# EAGLE board RT5350F_OLinuXino_Rev_F (EAGLE 4.16), part 1 of 2
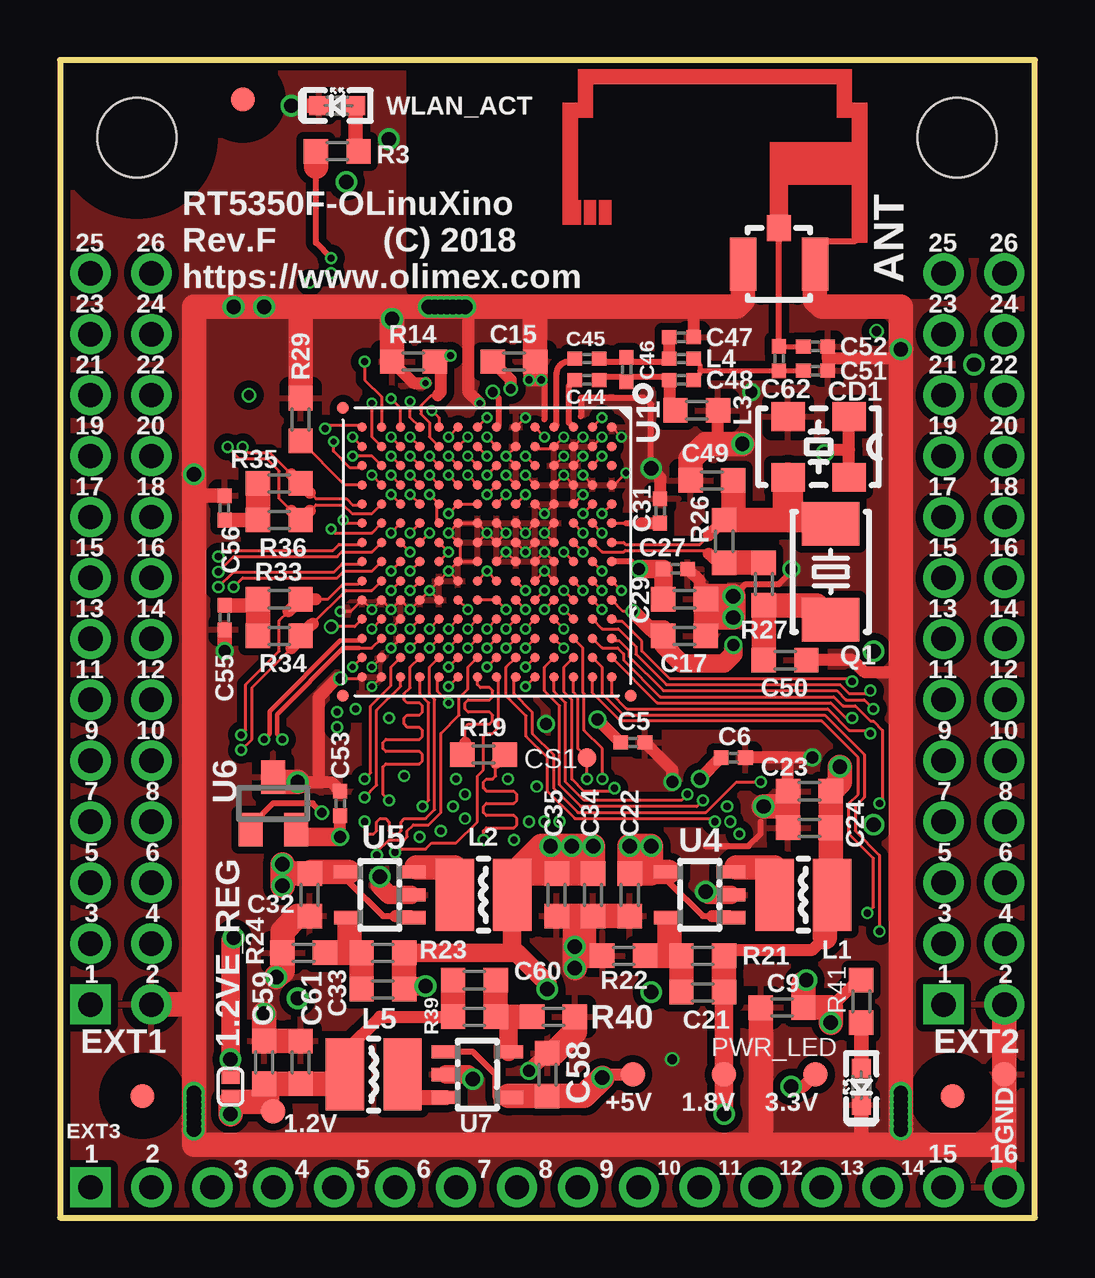
[diagram p2: board, top side]
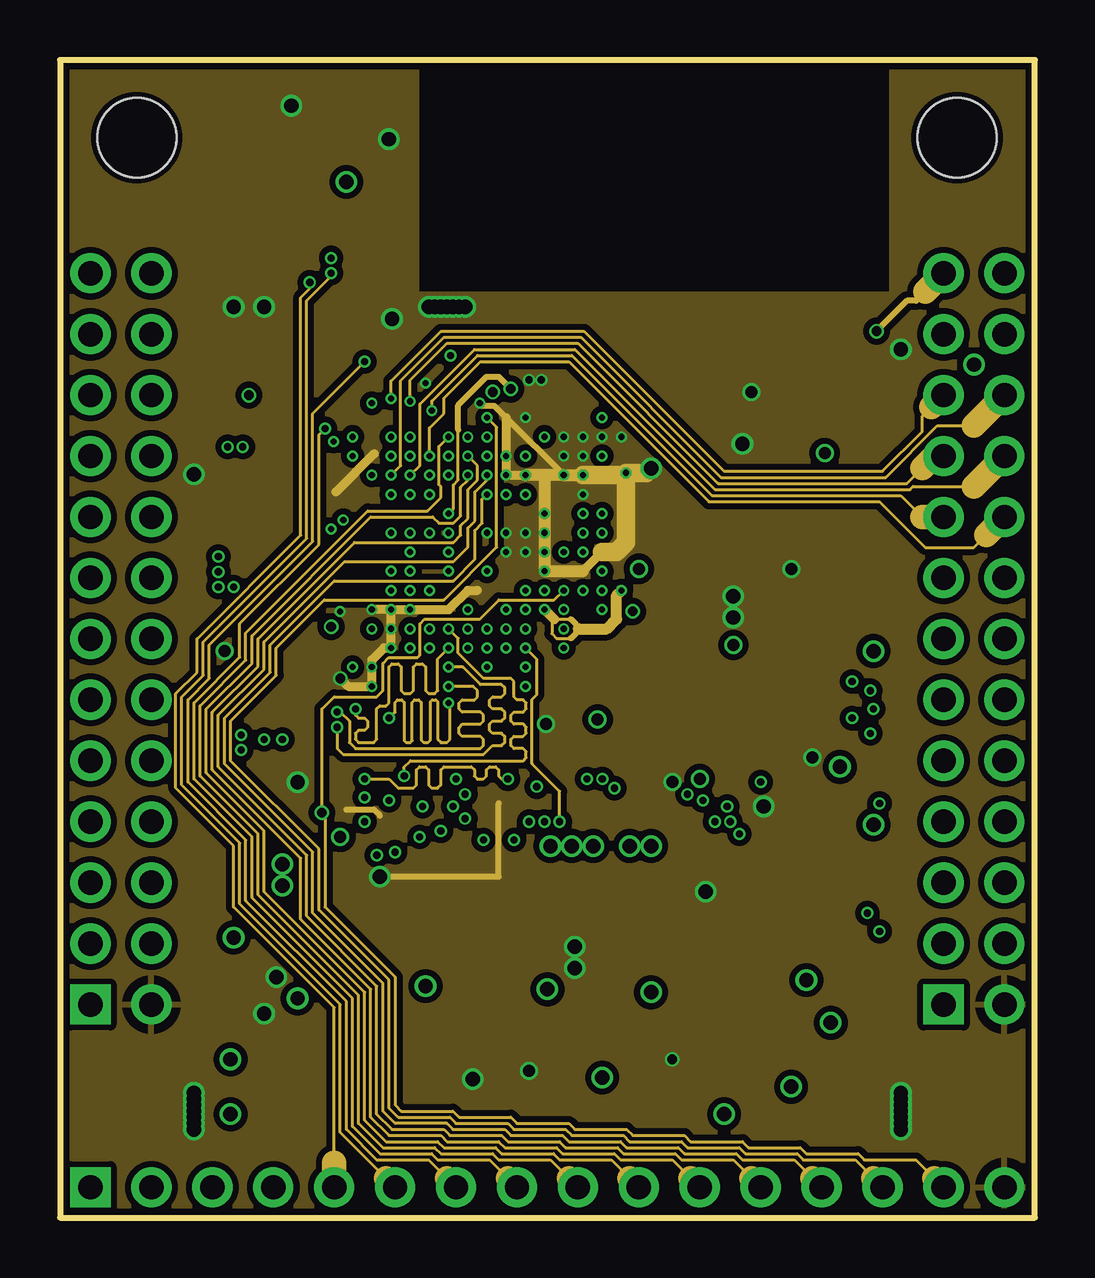
[diagram p3: board, inner layer GND]
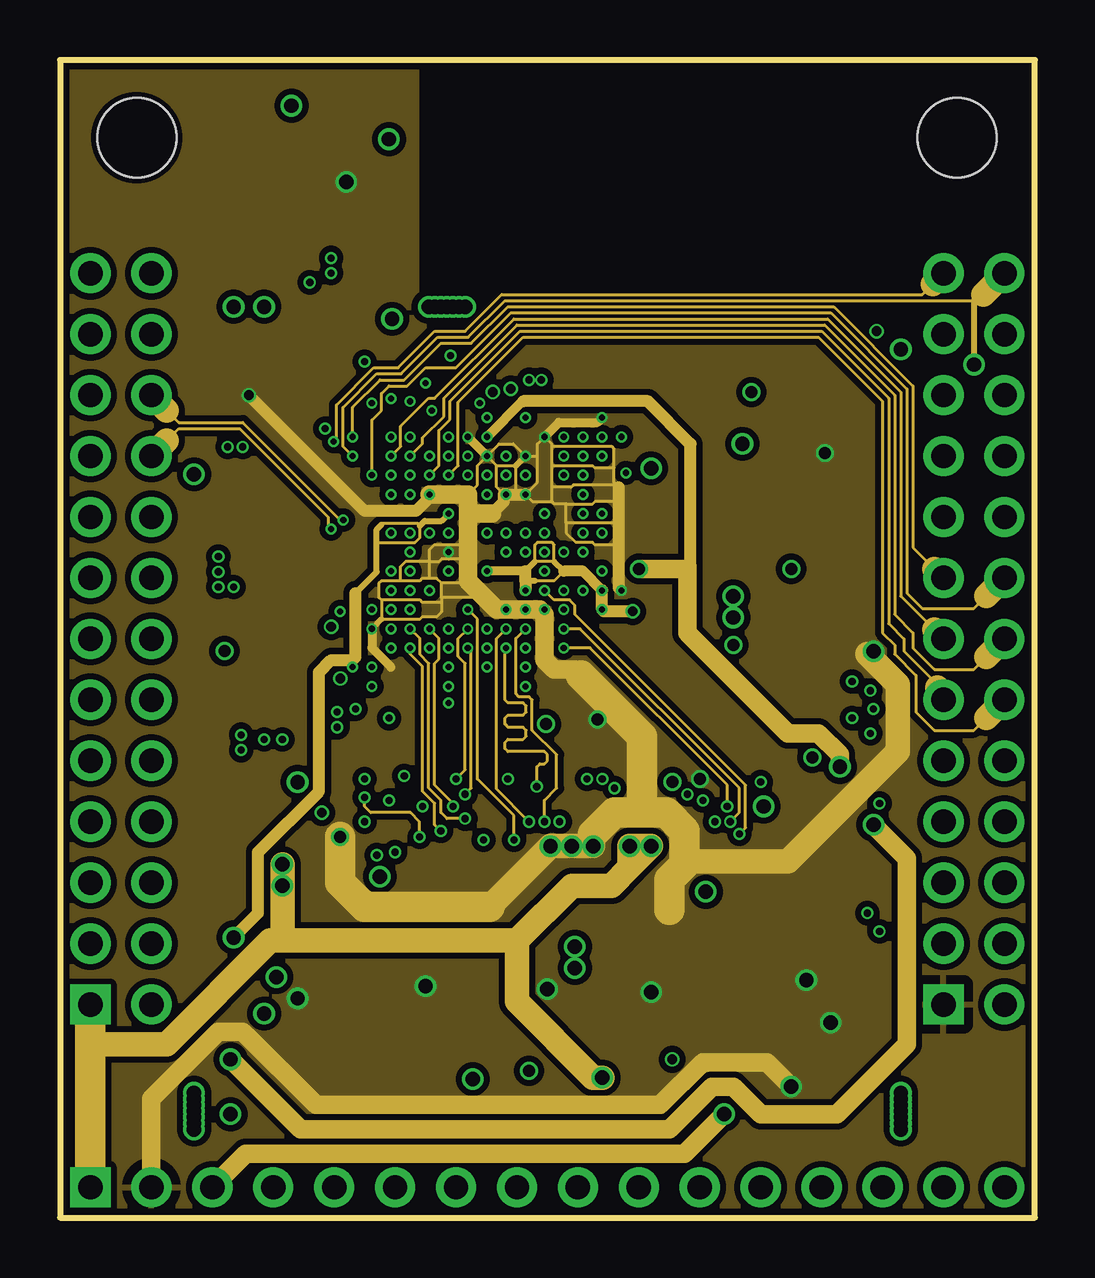
[diagram p4: board, inner layer PWR]
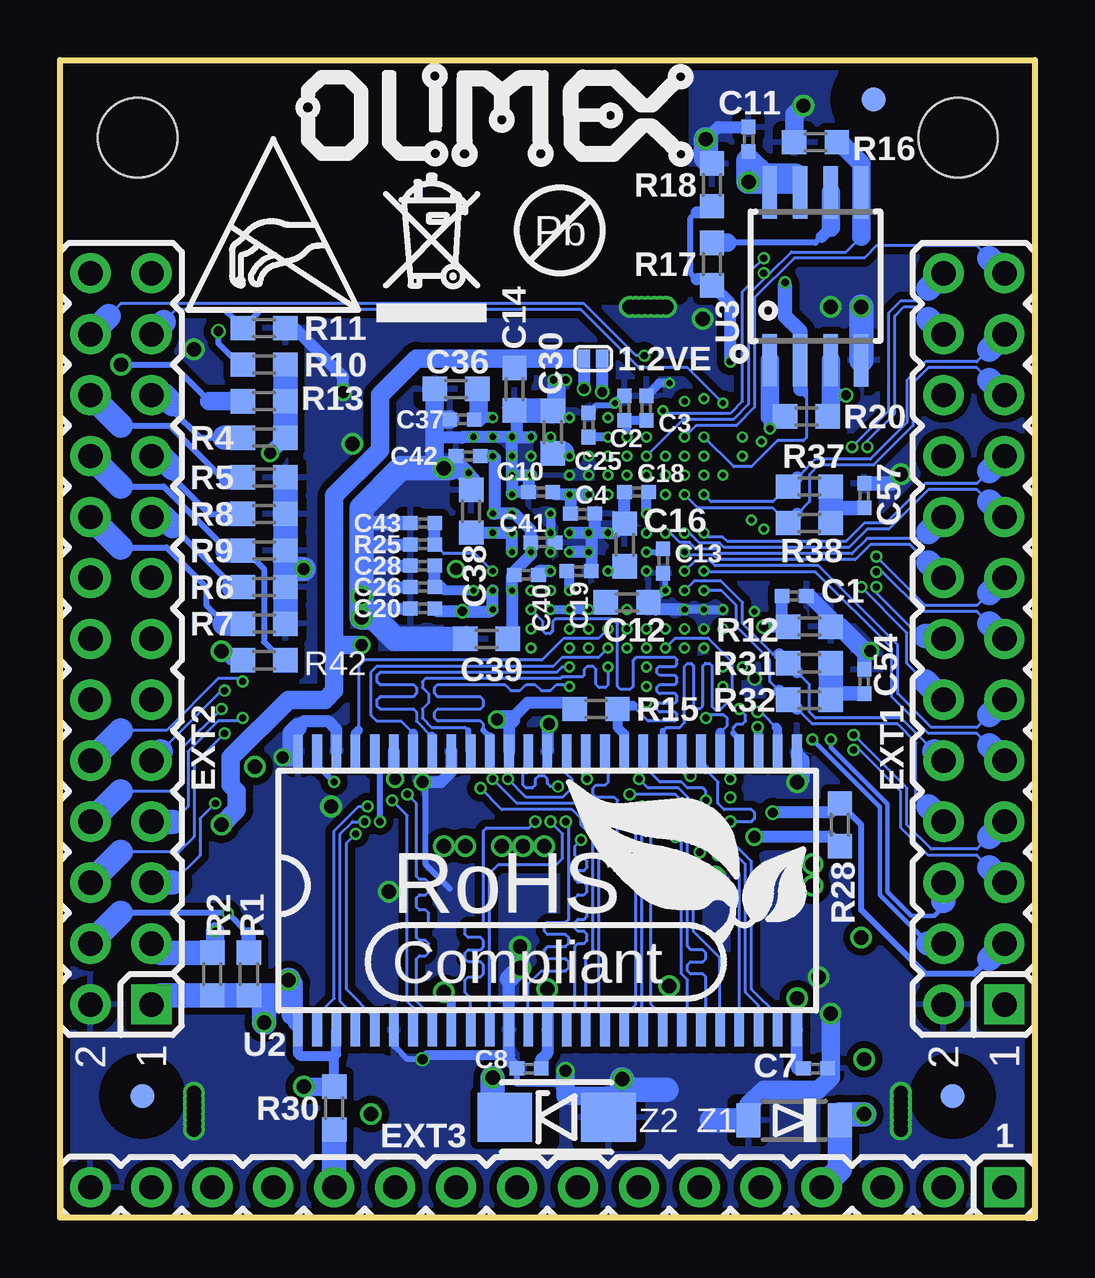
[diagram p5: board, bottom side, seen from below]

Size 40.64 x 48.26 mm. Coordinates in mm from the lower left corner, seen from the top.
Outline: 0,0 40.64,0 40.64,48.26 0,48.26 0,0
Copper layers (1+2*15+16): Top 0.035mm / dielectric 0.127mm / GND 0.035mm / dielectric 1.1mm / PWR 0.035mm / dielectric 0.127mm / Bottom 0.035mm
Design rules "default": minimum track width 4mil, minimum drill 0.25mm, track to track 5mil, track to pad 5mil, pad to pad 5mil, via to via 5mil, smd to smd 1mil, copper to edge 10mil, drill to drill 8mil, minimum pad ring 6mil, minimum via ring 4mil, stop-mask expansion 4mil, vias tented up to drill 28mil, thermal gap 15mil
Holes 3.3 mm at 3.2,45.02 37.4,45.02
tRestrict: area 34.4,42 to 40.4,48; area 0.2,42 to 6.2,48; 4 lines
bRestrict: area 0.2,42 to 6.2,48; area 34.4,42 to 40.4,48; 8 lines

## Footprints (pad centres in the part's own frame; a part is rotated, then mirrored left to right if it is on the bottom)
TESTPAD_40-ROUND = smd 1.016 x 1.016: 1 0,0
SJ_1_SMALLER = smd 0.508 x 0.762: 1 -0.381,0; 2 0.381,0
WIFI_RF = smd 1.1 x 1: ANT -2.183,0 | smd 2.2 x 1.1: GND1 -3.683,1.5; GND2 -3.683,-1.5
C0402_TI = smd 0.61 x 0.584: 1 -0.508,0; 2 0.508,0
C0603_DWS = smd 1.016 x 1.016: 1 -0.889,0; 2 0.889,0
5032-4P_HCX-3S = smd 1.4 x 1.2: 1 -1.27,-1.27; 2 1.27,-1.27; 3 1.27,1.27; 4 -1.27,1.27
TESTPAD_30-ROUND = smd 0.762 x 0.762: 1 0,0
HN2X13-MALE = drill 1.016 pad 1.676 square: 1 -15.24,-1.27 | drill 1.016 pad 1.676 round: 2 -15.24,1.27; 3 -12.7,-1.27; 4 -12.7,1.27; 5 -10.16,-1.27; 6 -10.16,1.27; 7 -7.62,-1.27; 8 -7.62,1.27; 9 -5.08,-1.27; 10 -5.08,1.27; 11 -2.54,-1.27; 12 -2.54,1.27; 13 0,-1.27; 14 0,1.27; 15 2.54,-1.27; 16 2.54,1.27; 17 5.08,-1.27; 18 5.08,1.27; 19 7.62,-1.27; 20 7.62,1.27; 21 10.16,-1.27; 22 10.16,1.27; 23 12.7,-1.27; 24 12.7,1.27; 25 15.24,-1.27; 26 15.24,1.27
HN1X16 = drill 1.016 pad 1.676 square: 1 -17.78,0 | drill 1.016 pad 1.676 round: 2 -15.24,0; 3 -12.7,0; 4 -10.16,0; 5 -7.62,0; 6 -5.08,0; 7 -2.54,0; 8 0,0; 9 2.54,0; 10 5.08,0; 11 7.62,0; 12 10.16,0; 13 12.7,0; 14 15.24,0; 15 17.78,0; 16 20.32,0
FIDUCIAL-1X3 = smd 1 x 1: 1 0,0
CD32 = smd 1.6 x 3: 1 -1.2,0; 2 1.2,0
L0603_5MIL_DWS = smd 1.016 x 1.016: 1 -0.889,0; 2 0.889,0
L0402_TI = smd 0.61 x 0.584: 1 -0.508,0; 2 0.508,0
LED-0603 = smd 0.8 x 0.8: A 0.762,0; C -0.762,0
HCX-4S = smd 1.8 x 2.4: 1 -2,0; 2 2,0
R0603_5MIL_DWS = smd 1.016 x 1.016: 1 -0.889,0; 2 0.889,0
R0402_TI = smd 0.61 x 0.584: 1 -0.508,0; 2 0.508,0
TFBGA196B = smd 0.4 x 0.4: A1 -5.2,-5.2; A2 -5.2,-4.4; A3 -5.2,-3.6; A4 -5.2,-2.8; A5 -5.2,-2; A6 -5.2,-1.2; A7 -5.2,-0.4; A8 -5.2,0.4; A9 -5.2,1.2; A10 -5.2,2; A11 -5.2,2.8; A12 -5.2,3.6; A13 -5.2,4.4; A14 -5.2,5.2; B1 -4.4,-5.2; B2 -4.4,-4.4; B3 -4.4,-3.6; B4 -4.4,-2.8; B5 -4.4,-2; B6 -4.4,-1.2; B7 -4.4,-0.4; B8 -4.4,0.4; B9 -4.4,1.2; B10 -4.4,2; B11 -4.4,2.8; B12 -4.4,3.6; B13 -4.4,4.4; B14 -4.4,5.2; C1 -3.6,-5.2; C2 -3.6,-4.4; C3 -3.6,-3.6; C4 -3.6,-2.8; C5 -3.6,-2; C6 -3.6,-1.2; C7 -3.6,-0.4; C8 -3.6,0.4; C9 -3.6,1.2; C10 -3.6,2; C11 -3.6,2.8; C12 -3.6,3.6; C13 -3.6,4.4; C14 -3.6,5.2; D1 -2.8,-5.2; D2 -2.8,-4.4; D3 -2.8,-3.6; D4 -2.8,-2.8; D5 -2.8,-2; D6 -2.8,-1.2; D7 -2.8,-0.4; D8 -2.8,0.4; D9 -2.8,1.2; D10 -2.8,2; D11 -2.8,2.8; D12 -2.8,3.6; D13 -2.8,4.4; D14 -2.8,5.2; E1 -2,-5.2; E2 -2,-4.4; E3 -2,-3.6; E4 -2,-2.8; E5 -2,-2; E6 -2,-1.2; E7 -2,-0.4; E8 -2,0.4; E9 -2,1.2; E10 -2,2; E11 -2,2.8; E12 -2,3.6; E13 -2,4.4; E14 -2,5.2; F1 -1.2,-5.2; F2 -1.2,-4.4; F3 -1.2,-3.6; F4 -1.2,-2.8; F5 -1.2,-2; F6 -1.2,-1.2; F7 -1.2,-0.4; F8 -1.2,0.4; F9 -1.2,1.2; F10 -1.2,2; F11 -1.2,2.8; F12 -1.2,3.6; F13 -1.2,4.4; F14 -1.2,5.2; G1 -0.4,-5.2; G2 -0.4,-4.4; G3 -0.4,-3.6; G4 -0.4,-2.8; G5 -0.4,-2; G6 -0.4,-1.2; G7 -0.4,-0.4; G8 -0.4,0.4; G9 -0.4,1.2; G10 -0.4,2; G11 -0.4,2.8; G12 -0.4,3.6; G13 -0.4,4.4; G14 -0.4,5.2; H1 0.4,-5.2; H2 0.4,-4.4; H3 0.4,-3.6; H4 0.4,-2.8; H5 0.4,-2; H6 0.4,-1.2; H7 0.4,-0.4; H8 0.4,0.4; H9 0.4,1.2; H10 0.4,2; H11 0.4,2.8; H12 0.4,3.6; H13 0.4,4.4; H14 0.4,5.2; J1 1.2,-5.2; J2 1.2,-4.4; J3 1.2,-3.6; J4 1.2,-2.8; J5 1.2,-2; J6 1.2,-1.2; J7 1.2,-0.4; J8 1.2,0.4; J9 1.2,1.2; J10 1.2,2; J11 1.2,2.8; J12 1.2,3.6; J13 1.2,4.4; J14 1.2,5.2; K1 2,-5.2; K2 2,-4.4; K3 2,-3.6; K4 2,-2.8; K5 2,-2; K6 2,-1.2; K7 2,-0.4; K8 2,0.4; K9 2,1.2; K10 2,2; K11 2,2.8; K12 2,3.6; K13 2,4.4; K14 2,5.2; L1 2.8,-5.2; L2 2.8,-4.4; L3 2.8,-3.6; L4 2.8,-2.8; L5 2.8,-2; L6 2.8,-1.2; L7 2.8,-0.4; L8 2.8,0.4; L9 2.8,1.2; L10 2.8,2; L11 2.8,2.8; L12 2.8,3.6; L13 2.8,4.4; L14 2.8,5.2; M1 3.6,-5.2; M2 3.6,-4.4; M3 3.6,-3.6; M4 3.6,-2.8; M5 3.6,-2; M6 3.6,-1.2; M7 3.6,-0.4; M8 3.6,0.4; M9 3.6,1.2; M10 3.6,2; M11 3.6,2.8; M12 3.6,3.6; M13 3.6,4.4; M14 3.6,5.2; N1 4.4,-5.2; N2 4.4,-4.4; N3 4.4,-3.6; N4 4.4,-2.8; N5 4.4,-2; N6 4.4,-1.2; N7 4.4,-0.4; N8 4.4,0.4; N9 4.4,1.2; N10 4.4,2; N11 4.4,2.8; N12 4.4,3.6; N13 4.4,4.4; N14 4.4,5.2; P1 5.2,-5.2; P2 5.2,-4.4; P3 5.2,-3.6; P4 5.2,-2.8; P5 5.2,-2; P6 5.2,-1.2; P7 5.2,-0.4; P8 5.2,0.4; P9 5.2,1.2; P10 5.2,2; P11 5.2,2.8; P12 5.2,3.6; P13 5.2,4.4; P14 5.2,5.2 | smd 0.5 x 0.5: FID1 6,-6; FID2 -6,6; FID3 6,6
54TSOPII = smd 0.4 x 1.4: 1 -10.4,-6; 2 -9.6,-6; 3 -8.8,-6; 4 -8,-6; 5 -7.2,-6; 6 -6.4,-6; 7 -5.6,-6; 8 -4.8,-6; 9 -4,-6; 10 -3.2,-6; 11 -2.4,-6; 12 -1.6,-6; 13 -0.8,-6; 14 0,-6; 15 0.8,-6; 16 1.6,-6; 17 2.4,-6; 18 3.2,-6; 19 4,-6; 20 4.8,-6; 21 5.6,-6; 22 6.4,-6; 23 7.2,-6; 24 8,-6; 25 8.8,-6; 26 9.6,-6; 27 10.4,-6; 28 10.4,5.6; 29 9.6,5.6; 30 8.8,5.6; 31 8,5.6; 32 7.2,5.6; 33 6.4,5.6; 34 5.6,5.6; 35 4.8,5.6; 36 4,5.6; 37 3.2,5.6; 38 2.4,5.6; 39 1.6,5.6; 40 0.8,5.6; 41 0,5.6; 42 -0.8,5.6; 43 -1.6,5.6; 44 -2.4,5.6; 45 -3.2,5.6; 46 -4,5.6; 47 -4.8,5.6; 48 -5.6,5.6; 49 -6.4,5.6; 50 -7.2,5.6; 51 -8,5.6; 52 -8.8,5.6; 53 -9.6,5.6; 54 -10.4,5.6
SO-8-BIG = smd 0.6 x 2.2: 1 -1.905,-3.5; 2 -0.635,-3.5; 3 0.635,-3.5; 4 1.905,-3.5; 5 1.905,3.5; 6 0.635,3.5; 7 -0.635,3.5; 8 -1.905,3.5
SOT23-5 = smd 1.2 x 0.55: 1 1.3,-0.95; 2 1.3,0; 3 1.3,0.95; 4 -1.3,0.95; 5 -1.3,-0.95
SOT23 = smd 1.4 x 1: 1 1.1,-0.95; 2 1.1,0.95; 3 -1.1,0
SOD-123 = smd 1 x 1.4: A 1.9,0; C -1.9,0
DO214AC = smd 2.286 x 2.032: A -2.159,0; C 2.159,0

## Placement (x,y rotation side)
1.2V  TESTPADTESTPAD_40-ROUND  [TESTPAD_40-ROUND]  8.89,4.44 0 top
1.2VE  Open  [SJ_1_SMALLER]  18.41,35.81 0 bottom
1.2VE_REG  Close  [SJ_1_SMALLER]  7.11,5.46 90 top
1.8V  TESTPADTESTPAD_40-ROUND  [TESTPAD_40-ROUND]  27.69,5.97 270 top
3.3V  3.3V  [TESTPAD_40-ROUND]  31.5,5.97 270 top
+5V  TESTPADTESTPAD_40-ROUND  [TESTPAD_40-ROUND]  23.88,5.97 180 top
ANT  WIFI_RF_I-PEX  [WIFI_RF]  29.97,43.43 90 top
C1  100nF  [C0402_TI]  10.03,25.92 0 bottom
C2  100nF  [C0402_TI]  17.1,33.75 90 bottom
C3  100nF  [C0402_TI]  16.2,33.75 90 bottom
C4  100nF  [C0402_TI]  18.85,29.35 0 bottom
C5  100nF  [C0402_TI]  23.88,19.81 0 top
C6  100nF  [C0402_TI]  28.07,19.18 0 top
C7  100nF  [C0402_TI]  9.14,6.22 0 bottom
C8  100nF  [C0402_TI]  21.08,6.22 180 bottom
C9  22uF/6.3V  [C0603_DWS]  30.1,8.76 180 top
C10  100nF  [C0402_TI]  20.6,30.25 180 bottom
C11  NA(100nF)  [C0402_TI]  11.94,44.96 90 bottom
C12  1uF  [C0603_DWS]  17,25.65 0 bottom
C13  100nF  [C0402_TI]  15.5,27.38 270 bottom
C14  1uF  [C0603_DWS]  21.69,34.54 270 bottom
C15  1uF  [C0603_DWS]  18.92,35.69 0 top
C16  1uF  [C0603_DWS]  17.1,28.05 90 bottom
C17  1uF  [C0603_DWS]  26.04,24.26 0 top
C18  100nF  [C0402_TI]  16.6,30.25 180 bottom
C19  100nF  [C0402_TI]  19,26.95 0 bottom
C20  100nF  [C0402_TI]  25.53,25.4 180 bottom
C21  22pF  [C0603_DWS]  26.8,9.4 180 top
C22  22uF/6.3V  [C0603_DWS]  23.75,13.46 270 top
C23  22uF/6.3V  [C0603_DWS]  31.24,17.78 180 top
C24  22uF/6.3V  [C0603_DWS]  31.24,16.26 180 top
C25  100nF  [C0402_TI]  18.6,33.05 90 bottom
C26  100nF  [C0402_TI]  25.53,26.29 180 bottom
C27  100nF  [C0402_TI]  25.65,27.05 0 top
C28  10pF  [C0402_TI]  25.53,27.18 180 bottom
C29  1uF  [C0603_DWS]  26.04,25.78 0 top
C30  1uF  [C0603_DWS]  20.1,32.75 90 bottom
C31  22nF  [C0402_TI]  25.02,29.46 90 top
C32  22uF/6.3V  [C0603_DWS]  10.41,13.46 270 top
C33  22pF  [C0603_DWS]  13.46,9.52 180 top
C34  22uF/6.3V  [C0603_DWS]  22.23,13.46 270 top
C35  22uF/6.3V  [C0603_DWS]  20.7,13.46 270 top
C36  1uF  [C0603_DWS]  24.13,34.54 180 bottom
C37  10pF  [C0402_TI]  23.88,33.27 180 bottom
C38  1uF  [C0603_DWS]  23.5,29.45 90 bottom
C39  1uF  [C0603_DWS]  22.86,24.13 180 bottom
C40  100pF  [C0402_TI]  21.2,26.8 0 bottom
C41  10pF  [C0402_TI]  20.5,28.15 0 bottom
C42  100nF  [C0402_TI]  23.62,31.75 180 bottom
C43  100pF  [C0402_TI]  25.53,28.96 180 bottom
C44  2.7pF  [C0402_TI]  21.97,34.92 0 top
C45  2.7pF  [C0402_TI]  21.97,35.81 0 top
C46  1.5pF  [C0402_TI]  23.62,35.36 270 top
C47  1.2pF  [C0402_TI]  25.91,36.7 0 top
C48  1.2pF  [C0402_TI]  25.91,34.92 0 top
C49  NA(6.8pF)  [C0603_DWS]  27.18,30.73 180 top
C50  22pF  [C0603_DWS]  30.23,23.24 0 top
C51  NA  [C0402_TI]  31.5,35.31 0 top
C52  NA  [C0402_TI]  31.5,36.32 0 top
C53  100nF  [C0402_TI]  11.68,17.27 90 top
C54  100nF  [C0402_TI]  7.11,22.35 90 bottom
C55  100nF  [C0402_TI]  6.86,25.02 270 top
C56  100nF  [C0402_TI]  6.86,29.59 90 top
C57  100nF  [C0402_TI]  7.11,30.1 90 bottom
C58  22uF/6.3V  [C0603_DWS]  20.32,5.97 90 top
C59  22uF/6.3V  [C0603_DWS]  8.51,6.48 90 top
C60  22pF  [C0603_DWS]  17.27,9.91 0 top
C61  22uF/6.3V  [C0603_DWS]  10.03,6.48 90 top
C62  10pF  [C0402_TI]  29.97,35.81 90 top
CD1  NA(20MHz/5032/20ppm/3.3V)  [5032-4P_HCX-3S]  31.62,32.13 180 top
CS1  TESTPADTESTPAD30/30  [TESTPAD_30-ROUND]  21.97,19.18 0 top
EXT1  ML26HN2X13  [HN2X13-MALE]  2.54,24.13 90 bottom
EXT2  ML26HN2X13  [HN2X13-MALE]  38.1,24.13 90 bottom
EXT3  HN1X16  [HN1X16]  19.05,1.27 180 bottom
FID1  FIDUCIAL  [FIDUCIAL-1X3]  7.62,46.61 90 top
FID2  FIDUCIAL  [FIDUCIAL-1X3]  37.21,5.08 90 top
FID3  FIDUCIAL  [FIDUCIAL-1X3]  3.43,5.08 90 top
FID4  FIDUCIAL  [FIDUCIAL-1X3]  6.73,46.61 270 bottom
FID5  FIDUCIAL  [FIDUCIAL-1X3]  37.21,5.08 270 bottom
FID6  FIDUCIAL  [FIDUCIAL-1X3]  3.43,5.08 270 bottom
GND  TESTPADTESTPAD_40-ROUND  [TESTPAD_40-ROUND]  39.37,5.97 270 top
L1  2.2uH/1.5A/DCR<0.1R/CD32  [CD32]  30.99,13.46 0 top
L2  2.2uH/1.5A/DCR<0.1R/CD32  [CD32]  17.65,13.46 0 top
L3  2.2nH  [L0603_5MIL_DWS]  26.54,33.66 0 top
L4  2.7nH  [L0402_TI]  25.91,35.81 0 top
L5  2.2uH/1.5A/DCR<0.1R/CD32  [CD32]  13.08,5.97 180 top
PWR_LED  LED/RED/0603  [LED-0603]  33.4,5.46 90 top
Q1  E4SB20.000F20E15(20MHz/9pF/10ppm/5x3.2mm)  [HCX-4S]  32.13,26.92 90 top
R1  2.2k  [R0603_5MIL_DWS]  32.77,10.16 270 bottom
R2  2.2k  [R0603_5MIL_DWS]  34.29,10.16 270 bottom
R3  2.2k  [R0603_5MIL_DWS]  11.56,44.45 180 top
R4  4.7k  [R0603_5MIL_DWS]  32.13,32.51 0 bottom
R5  4.7k  [R0603_5MIL_DWS]  32.13,30.86 0 bottom
R6  4.7k  [R0603_5MIL_DWS]  32.13,26.29 0 bottom
R7  4.7k  [R0603_5MIL_DWS]  32.13,24.77 0 bottom
R8  4.7k  [R0603_5MIL_DWS]  32.13,29.34 0 bottom
R9  4.7k  [R0603_5MIL_DWS]  32.13,27.81 0 bottom
R10  4.7k  [R0603_5MIL_DWS]  32.13,35.56 0 bottom
R11  4.7k  [R0603_5MIL_DWS]  32.13,37.08 0 bottom
R12  8.2k/1%  [R0603_5MIL_DWS]  9.4,24.64 0 bottom
R13  4.7k  [R0603_5MIL_DWS]  32.13,34.04 0 bottom
R14  4.7k  [R0603_5MIL_DWS]  14.73,35.69 180 top
R15  4.7k  [R0603_5MIL_DWS]  18.29,21.21 0 bottom
R16  4.7k  [R0603_5MIL_DWS]  9.14,44.83 0 bottom
R17  22R  [R0603_5MIL_DWS]  13.46,39.75 270 bottom
R18  4.7k  [R0603_5MIL_DWS]  13.46,43.05 90 bottom
R19  22R  [R0603_5MIL_DWS]  17.65,19.3 0 top
R20  NA(47k)  [R0603_5MIL_DWS]  9.53,33.4 180 bottom
R21  5.62k/1%  [R0603_5MIL_DWS]  26.8,10.92 180 top
R22  2.74k/1%  [R0603_5MIL_DWS]  23.5,10.92 180 top
R23  4.99k/1%  [R0603_5MIL_DWS]  13.46,11.05 180 top
R24  1.1k/1%  [R0603_5MIL_DWS]  10.16,11.05 180 top
R25  12k/1%  [R0402_TI]  25.53,28.07 0 bottom
R26  NA(1M)  [R0603_5MIL_DWS]  27.69,28.19 270 top
R27  330R  [R0603_5MIL_DWS]  29.34,26.42 270 top
R28  NA(10k)  [R0603_5MIL_DWS]  8.13,16.38 90 bottom
R29  9.1k/1%  [R0603_5MIL_DWS]  10.03,33.27 90 top
R30  4.7k  [R0603_5MIL_DWS]  29.21,4.57 90 bottom
R31  49.9/1%  [R0603_5MIL_DWS]  9.4,23.11 0 bottom
R32  49.9/1%  [R0603_5MIL_DWS]  9.4,21.59 0 bottom
R33  49.9/1%  [R0603_5MIL_DWS]  9.14,25.78 180 top
R34  49.9/1%  [R0603_5MIL_DWS]  9.14,24.26 180 top
R35  49.9/1%  [R0603_5MIL_DWS]  9.14,30.61 180 top
R36  49.9/1%  [R0603_5MIL_DWS]  9.14,29.08 180 top
R37  49.9/1%  [R0603_5MIL_DWS]  9.4,30.48 0 bottom
R38  49.9/1%  [R0603_5MIL_DWS]  9.4,28.96 0 bottom
R39  1.1k/1%  [R0603_5MIL_DWS]  17.27,8.38 0 top
R40  1.1k/1%  [R0603_5MIL_DWS]  20.57,8.38 0 top
R41  2.2k  [R0603_5MIL_DWS]  33.4,9.02 90 top
R42  NA(4.7k)  [R0603_5MIL_DWS]  32.13,23.24 180 bottom
U1  RT5350  [TFBGA196B]  17.8,27.75 180 top
U2  W9825G6JH-6  [54TSOPII]  20.32,13.84 0 bottom
U3  EN25Q64-104HIP  [SO-8-BIG]  9.14,39.24 0 bottom
U4  SY8089AAAC(SOT23-5)  [SOT23-5]  26.67,13.46 0 top
U5  SY8089AAAC(SOT23-5)  [SOT23-5]  13.34,13.46 0 top
U6  MCP130T-300I/TT  [SOT23]  8.89,17.27 270 top
U7  SY8089AAAC(SOT23-5)  [SOT23-5]  17.4,5.97 180 top
U$3  [PB_SMALL]  19.81,41.15 0 bottom
U$8  [RECYCLE_BIN1/8]  27.43,37.34 0 bottom
U$9  [ROHS]  26.8,9.78 0 bottom
U$10  [OLIMEX1_V]  13.08,43.69 0 bottom
U$11  [ESD_SYMBOL]  35.31,37.85 0 bottom
WLAN_ACT  LED/Yellow/0603  [LED-0603]  11.56,46.36 0 top
Z1  NA(DDZ9678-7(SOD-123)_Farnell_PN-1858631)  [SOD-123]  10.03,4.06 180 bottom
Z2  SMAZ5V6-TP(Farnell_PN-1924469)  [DO214AC]  19.94,4.19 180 bottom

## Tracks (layer width: path | path; a pad name or v marks a point on that pad's centre or on a via)
1.2V  (via drill 0.25, 0.4, 0.5, 0.6)
  Top 0.127: v12.2,22.95 U1.P13 | v22.6,25.35 U1.B10 | v22.6,26.15 U1.B9 | v19.4,26.15 U1.F9 | U1.G9 v17.8,26.95 U1.H9 | U1.H5 U1.J5 v16.2,29.35 | v23.88,25.27 23.48,25.27 U1.A10
  Top 0.508: v18.8,34.54 18.8,34.92 C15.1 | 1.2VE_REG.2 7.11,6.1
  Top 0.61: 24.77,24.51 24.64,24.51 v23.88,25.27
  Top 0.762: 24.77,24.51 25.15,24.51 C17.1 25.15,23.88 25.91,23.11 27.69,23.11 28.07,23.49 v28.07,23.88 | 7.11,6.1 v7.11,6.6 7.11,11.56 v7.24,11.68
  GND 0.127: v16.2,29.35 16.4,29.55 16.4,30.55 16.6,30.75 16.6,32.85
  GND 0.254: v18.8,34.54 18.29,35.05 17.78,35.05 16.6,33.87 16.6,32.85
  PWR 0.127: 21,26.95 20.6,26.55 19.8,26.55 | 13.4,28.89 13.47,28.95 14.9,28.95 15,28.85 15,28.35 14.8,28.15 13.21,28.15 | 20.6,27.35 19.8,27.35 19.8,28.05 19.9,28.15 20.5,28.15 20.6,28.05 20.6,27.35
  PWR 0.254: v12.2,22.95 v12.19,22.96 12.19,23.24 | 12.32,26.03 13.21,26.92 13.21,28.15 13.21,28.69 13.4,28.89 | 21,26.95 20.6,27.35 | 19.8,27.35 19.4,26.95 | 19.8,26.55 19.4,26.55 | 15,28.85 15.2,29.05 15.9,29.05 v16.2,29.35
  PWR 0.381: 19.4,26.95 v17.8,26.95
  PWR 0.432: v22.6,26.15 21.8,26.95
  PWR 0.457: 21.8,26.95 21,26.95
  PWR 0.508: 12.32,26.03 12.32,23.37 12.19,23.24 11.3,23.24 10.79,22.73 10.79,17.78 8.26,15.24 8.26,12.7 v7.24,11.68 | v23.88,25.27 22.68,25.27 v22.6,25.35 v22.6,26.15 | v19.4,26.15 19.4,26.55 19.4,26.95
  PWR 0.762: v7.11,6.6 10.03,3.68 25.4,3.68 27.18,5.46 28.07,5.46 29.21,4.32 32.38,4.32 35.31,7.24 35.31,14.99 v33.91,16.38
  Bottom 0.406: 22.68,25.27 v22.6,25.35 | v16.2,29.35 16.2,30.14 C18.1 | v19.4,26.15 19.4,26.84 C19.1 | C16.1 17.31,26.95 v17.8,26.95
  Bottom 0.508: 22.68,25.27 v23.88,25.27 24.89,25.27 C20.1 | v22.6,25.35 v22.6,26.15 | v18.8,34.54 1.2VE.1 18.92,35.81
  Bottom 0.762: 21.69,35.81 25.78,35.81 27.3,34.29 27.3,32 29.21,30.1 29.21,23.88 | 29.21,23.88 v28.07,23.88 | 21.69,35.81 18.92,35.81 | 21.69,35.81 C14.1 | v33.91,16.38 33.27,17.02 33.27,17.78 33.53,18.03 33.53,19.18 31.11,21.59 29.59,21.59 29.21,21.97 29.21,23.88
+5V  (via drill 0.6)
  Top 0.254: 13.97,12.57 13.46,12.57 12.04,14 U5.4 | 27.18,12.57 26.8,12.57 25.37,14 U4.4 | U7.1 17.21,6.92 18.16,5.97 18.16,5.02 U7.4
  Top 0.508: U5.1 14.63,12.57 13.97,12.57 | U4.1 27.91,12.57 27.18,12.57 | 18.7,5.08 U7.4 | v22.61,5.84 22.73,5.97 +5V.1
  Top 1.016: v9.27,14.73 9.27,14.35 | 9.27,14.35 C32.1 10.47,14.41 U5.4 | v9.27,13.84 9.27,14.35 | 24.64,14.35 v24.64,15.49 v23.75,15.49 C22.1 24.64,14.35 | U4.4 24.7,14.41 24.64,14.35 | 18.7,5.08 C58.1 21.84,5.08 v22.61,5.84
  PWR 1.016: 1.27,7.24 4.45,7.24 8.76,11.56 9.27,11.56 | v9.27,13.84 v9.27,14.73 v9.27,13.84 | 23.75,14.61 v23.75,15.49 v24.64,15.49 23.75,14.61 | 23.75,14.61 22.99,13.84 21.34,13.84 19.05,11.56 | 9.27,11.56 19.05,11.56 | 9.27,11.56 v9.27,13.84 | v22.61,5.84 22.23,5.84 19.05,9.02 19.05,11.56
  PWR 1.27: EXT1.1 1.27,7.24 EXT3.1
  Bottom 1.016: Z2.C 22.61,4.7 v22.61,5.84
A0  (via drill 0.3)
  Top 0.127: U1.G14 18.2,22.52 18.29,22.43 18.29,20.45 18.03,20.19 17.78,20.19 17.65,20.07 17.65,18.67 17.4,18.41 17.4,16.51 16.51,15.62 15.49,15.62 15.24,15.37 14.1,15.37 v13.97,15.24
  Bottom 0.127: U2.23 13.12,10.83 14.22,11.94 14.22,14.99 v13.97,15.24
A1  (via drill 0.3)
  Top 0.127: U1.H13 17,22.95 17,22.03 16.64,21.67 16.64,20.95 15.88,20.19 15.88,16.89 15.37,16.38 14.73,16.38 14.48,16.13 14.48,15.88 14.35,15.75 13.72,15.75 13.21,15.24 v13.21,15.11
  Bottom 0.127: U2.24 12.32,9.27 12.32,14.35 13.08,15.11 v13.21,15.11
A2  (via drill 0.25, 0.3)
  Top 0.127: v17,23.75 U1.H12
  PWR 0.127: v16.89,17.65 17.14,17.91 17.14,23.6 v17,23.75
  Bottom 0.127: U2.25 11.52,8.85 12.06,9.4 12.06,14.73 14.99,17.65 v16.89,17.65
A3  (via drill 0.25, 0.3)
  Top 0.127: v17,24.55 U1.H11
  PWR 0.127: v17,24.55 16.6,24.15 16.6,23.41 16.89,23.11 16.89,18.67 v16.51,18.29
  Bottom 0.127: U2.26 10.72,8.43 11.81,9.52 11.81,14.86 14.86,17.91 16.13,17.91 v16.51,18.29
A4  (via drill 0.25, 0.3)
  Top 0.127: v16.2,22.15 U1.J14
  GND 0.127: v11.56,21.08 11.68,21.08 12.06,20.7 12.06,19.81 12.32,19.56 17.53,19.56 17.65,19.69 17.65,19.94 17.53,20.07 16.76,20.07 16.64,20.19 16.64,20.45 16.76,20.57 17.53,20.57 17.65,20.7 17.65,20.95 17.53,21.08 16.76,21.08 16.64,21.21 16.64,21.46 16.76,21.59 17.27,21.59 17.4,21.72 17.4,21.97 17.22,22.15 v16.2,22.15
  Bottom 0.127: 10.79,20.45 11.3,20.95 11.43,21.08 v11.56,21.08
  Bottom 0.381: U2.29 10.72,20.37 10.79,20.45
A5  (via drill 0.25, 0.3)
  Top 0.127: v16.2,22.95 U1.J13
  GND 0.127: v11.56,20.45 11.56,19.56 11.81,19.3 17.65,19.3 18.03,19.69 18.41,19.69 18.54,19.81 18.54,20.07 18.41,20.19 18.03,20.19 17.91,20.32 17.91,20.57 18.03,20.7 18.41,20.7 18.54,20.83 18.54,21.08 18.41,21.21 18.03,21.21 17.91,21.34 17.91,21.59 18.03,21.72 18.41,21.72 18.54,21.84 18.54,22.1 18.41,22.23 17.53,22.23 16.8,22.95 v16.2,22.95
  Bottom 0.381: U2.30 11.52,20.41 v11.56,20.45
A6  (via drill 0.25, 0.3)
  Top 0.127: v16.2,23.75 U1.J12
  GND 0.127: v16.2,23.75 15.75,23.3 15.75,21.97 15.62,21.84 15.37,21.84 15.24,21.97 15.24,22.96 15.11,23.09 14.86,23.09 14.73,22.96 14.73,21.97 14.61,21.84 14.35,21.84 14.22,21.97 14.22,22.96 14.1,23.09 13.84,23.09 13.72,22.96 13.72,21.46 13.59,21.34 13.34,21.34 13.21,21.21 13.21,19.94 13.08,19.81 12.45,19.81 12.32,19.94 12.32,20.19 12.45,20.32 12.7,20.32 12.83,20.45 12.83,20.7 12.7,20.83 12.45,20.83 12.32,20.95 v12.32,21.21
  Bottom 0.127: 12.57,20.19 12.57,20.45 12.45,20.57 12.19,20.57 12.06,20.7 12.06,20.95 v12.32,21.21
  Bottom 0.254: U2.31 12.32,19.94 12.57,20.19
A7  (via drill 0.25, 0.3)
  Top 0.127: U1.K14 15.75,22.5 15.75,21.94 16.2,21.49 v16.2,21.45
  GND 0.127: v13.72,20.83 13.97,21.08 13.97,21.49 14.07,21.59 14.25,21.59 14.35,21.49 14.35,19.89 14.43,19.81 14.6,19.81 14.68,19.89 14.68,21.49 14.78,21.59 14.96,21.59 15.06,21.49 15.06,19.91 15.16,19.81 15.34,19.81 15.44,19.91 15.44,21.51 15.52,21.59 15.67,21.59 15.75,21.51 15.75,19.94 15.88,19.81 16.13,19.81 16.26,19.94 16.26,21.39 v16.2,21.45
  Bottom 0.127: v13.72,20.83 13.59,20.95 12.95,20.95 12.83,20.83 12.83,20.52 13.12,20.23
  Bottom 0.381: U2.32 13.12,20.23
A8  (via drill 0.3)
  Top 0.127: U1.K13 15.4,22.95 15.4,21.82 15.62,21.6 15.62,17.02 15.24,16.64 14.35,16.64 14.22,16.51 14.22,16.13 14.1,16 13.84,16 13.72,16.13 13.72,16.51 13.59,16.64 13.34,16.64 13.21,16.51 13.21,16.13 13.08,16 12.83,16 12.7,16.13 v12.7,16.51
  Bottom 0.127: 13.72,18.67 13.21,18.16 13.21,17.27 12.95,17.02 11.81,17.02 11.68,16.89 11.68,16.64 11.81,16.51 v12.7,16.51
  Bottom 0.381: U2.33 13.92,18.87 13.72,18.67
A9  (via drill 0.25, 0.3)
  Top 0.127: v16.2,24.55 U1.J11
  GND 0.127: v14.35,18.41 14.35,18.8 14.61,19.05 19.3,19.05 19.43,19.18 19.43,19.43 19.3,19.56 18.92,19.56 18.8,19.69 18.8,19.94 18.92,20.07 19.3,20.07 19.43,20.19 19.43,20.45 19.3,20.57 18.92,20.57 18.8,20.7 18.8,20.95 18.92,21.08 19.3,21.08 19.43,21.21 19.43,21.46 19.3,21.59 19.05,21.59 18.92,21.72 18.92,22.35 18.8,22.48 17.65,22.48 16.6,23.53 16.6,24.15 v16.2,24.55
  Bottom 0.127: U2.34 14.73,19.45
  Bottom 0.381: U2.34 14.72,18.78 v14.35,18.41
A10  (via drill 0.3)
  Top 0.127: v15.11,17.14 15.37,17.4 15.37,21.46 15,21.83 U1.L14
  Bottom 0.127: U2.22 13.92,8.33 13.72,8.54 13.72,10.03 13.84,10.16 14.35,10.16 14.48,10.29 14.48,10.54 14.35,10.67 13.84,10.67 13.72,10.79 13.72,11.05 13.84,11.18 14.35,11.18 14.48,11.3 14.48,16.51 v15.11,17.14
A11  (via drill 0.25)
  Top 0.127: v15.4,23.75 U1.K12
  Bottom 0.127: v15.4,23.75 15,24.15 13.6,24.15 12.6,23.15 12.6,21.69 13.08,21.21 13.36,21.21 13.46,21.31 13.46,23 13.56,23.11 13.74,23.11 13.84,23 13.84,21.34 13.95,21.23 14.12,21.23 14.22,21.34 14.22,23 14.33,23.11 14.48,23.11 14.61,22.98 14.61,20.64 14.82,20.42 15.39,20.42 15.52,20.29
  Bottom 0.254: 15.52,20.29 U2.35
A12  (via drill 0.3)
  Top 0.127: U1.L13 14.6,22.95 14.6,22.09 14.35,21.84 14.35,21.59 14.48,21.46 14.99,21.46 15.11,21.34 15.11,21.08 14.99,20.95 14.48,20.95 14.35,20.83 14.35,20.57 14.48,20.45 14.99,20.45 15.11,20.32 15.11,20.07 14.99,19.94 13.59,19.94 13.46,19.81 13.46,19.56 13.59,19.43 14.99,19.43 15.11,19.3 15.11,19.05 14.99,18.92 13.59,18.92 13.46,18.8 13.46,17.65 v13.72,17.4
  Bottom 0.127: 16.32,18.86 15.62,18.16 14.73,18.16 14.48,17.91 13.84,17.91 13.72,17.78 v13.72,17.4
  Bottom 0.381: 16.32,18.86 U2.36
BA0  (via drill 0.25, 0.3)
  Top 0.127: v14.6,23.75 U1.L12
  PWR 0.127: v14.6,23.75 14.6,23.5 15.11,22.99 15.11,17.78 15.62,17.27 15.62,16.38 v15.88,16.13
  Bottom 0.127: v15.88,16.13 16,16 16,8.89 15.49,8.38 15.49,7.87 U2.20
BA1  (via drill 0.3)
  Top 0.127: U1.M14 14.2,22.15 13.21,21.16 13.21,18.03 v12.7,17.53
  PWR 0.127: v14.99,15.88 14.99,16.51 14.61,16.89 12.95,16.89 12.7,17.14 v12.7,17.53
  Bottom 0.127: v14.99,15.88 14.73,15.62 14.73,10.16 14.48,9.91 14.48,8.64 14.72,8.39 U2.21
CAS  (via drill 0.3)
  Top 0.127: U1.C12 21.8,23.75 21.8,21.89 21.84,21.84 21.84,20.32 22.61,19.56 v22.61,18.29
  Bottom 0.127: v22.61,18.29 21.59,17.27 19.18,17.27 18.67,16.76 18.67,16.51 18.16,16 18.16,8.64 17.92,8.39 U2.17
COMP  (via drill 0.25)
  Top 0.127: v17.8,30.15 U1.G4
  GND 0.127: v17.8,30.15 17.6,29.95 17.6,28.95 17.3,28.65 17.3,27.45 16.4,26.55 11.44,26.55 8.76,23.88 8.76,22.73 6.86,20.83 6.86,18.92 10.54,15.24 10.54,12.7 13.46,9.78 13.46,4.44 13.97,3.94 16.13,3.94 16.38,3.68 18.54,3.68 18.8,3.43 20.95,3.43 21.21,3.17 23.37,3.17 23.62,2.92 25.78,2.92 26.04,2.67 28.19,2.67 28.45,2.41 30.61,2.41 31.37,1.65
  GND 1.016: 31.37,1.65 EXT3.13
CS  (via drill 0.25, 0.3)
  Top 0.127: v15.4,24.55 U1.K11
  PWR 0.127: v15.4,24.55 15.8,24.15 15.8,23.29 15.62,23.11 15.62,18.03 16.38,17.27 v16.38,17.14
  Bottom 0.127: U2.19 16.38,7.91 v16.38,17.14
CS1  (via drill 0.3)
  Top 0.127: U1.C14 21.4,21.91 21.59,21.72 21.59,19.56 CS1.1 v21.97,18.29
  Bottom 0.127: U2.40 19.52,18.5 19.3,18.29 19.3,17.91 19.68,17.53 21.21,17.53 v21.97,18.29
CTS_N  (via drill 0.25)
  Top 0.127: U1.K4 v15.4,30.95
  PWR 0.127: v15.4,30.95 15.8,31.35 15.8,32.82 16.26,33.27 16.26,34.04 19.18,36.96 31.75,36.96 34.54,34.16 34.54,24.77 35.18,24.13 35.18,23.62 36.58,22.23 36.58,22.1
  PWR 1.016: 36.58,22.1 36.83,21.84 EXT2.11
D0  (via drill 0.25, 0.3)
  Top 0.127: v20.2,26.15 U1.E10
  PWR 0.127: v20.2,26.15 20.6,25.75 21.24,25.75 21.46,25.53 21.46,25.15 28.57,18.03 28.57,16.26 v28.32,16
  Bottom 0.127: v28.32,16 28.7,15.62 28.7,9.52 27.52,8.34 U2.5
D1  (via drill 0.25, 0.3)
  Top 0.127: v21,24.55 U1.D11
  PWR 0.127: v27.94,16.51 28.32,16.89 28.32,17.91 21.68,24.55 v21,24.55
  Bottom 0.127: v27.94,16.51 28.45,16.51 28.96,16 28.96,9.02 28.32,8.38 U2.4
D2  (via drill 0.25, 0.3)
  Top 0.127: v21,23.75 U1.D12
  PWR 0.127: v27.81,17.14 27.81,18.03 22.1,23.75 v21,23.75
  Bottom 0.127: 29.97,7.79 U2.2 29.92,8.43 29.21,9.14 29.21,16.13 28.19,17.14 v27.81,17.14
D3  (via drill 0.3)
  Top 0.127: U1.D13 20.2,22.95 20.2,21.96 20.83,21.34 20.83,18.03 21.72,17.14 26.54,17.14 v26.8,17.4
  Bottom 0.127: v26.8,17.4 26.16,16.76 26.16,9.02 25.92,8.77 U2.7
D4  (via drill 0.3)
  Top 0.127: v26.16,17.65 25.91,17.4 21.84,17.4 21.08,18.16 21.08,21.46 20.6,21.95 U1.D14
  Bottom 0.127: v26.16,17.65 25.78,17.27 25.78,14.22 25.65,14.1 25.4,14.1 25.27,13.97 25.27,13.59 25.4,13.46 25.65,13.46 25.78,13.34 25.78,12.95 25.65,12.83 25.4,12.83 25.27,12.7 25.27,12.32 25.4,12.19 25.65,12.19 25.78,12.06 25.78,11.68 25.65,11.56 25.4,11.56 25.27,11.43 25.27,11.05 25.4,10.92 25.65,10.92 25.78,10.79 25.78,9.02 25.12,8.36 U2.8
D5  (via drill 0.25, 0.3)
  Top 0.127: v19.4,24.55 U1.E11
  PWR 0.127: v19.4,24.55 19,24.15 19,21.83 19.12,21.72 19.56,21.72 19.68,21.59 19.68,20.32 20.7,19.3 20.7,17.91 20.19,17.4 v20.19,16.51
  Bottom 0.127: v20.19,16.51 19.68,16 19.68,14.99 19.94,14.73 22.35,14.73 22.73,14.35 22.73,7.86 U2.11
D6  (via drill 0.25, 0.3)
  Top 0.127: v18.6,24.55 U1.F11
  PWR 0.127: v18.6,24.55 18.2,24.15 18.2,17.87 v19.56,16.51
  Bottom 0.127: v19.56,16.51 19.43,16.38 19.43,12.45 19.56,12.32 20.32,12.32 20.45,12.19 20.45,11.94 20.32,11.81 19.56,11.81 19.43,11.68 19.43,11.43 19.56,11.3 20.32,11.3 20.45,11.18 20.45,10.92 20.32,10.79 19.56,10.79 19.43,10.67 19.43,10.41 19.56,10.29 20.57,10.29 21.12,9.74 U2.13
D7  (via drill 0.25, 0.3)
  Top 0.127: v19.4,23.75 U1.E12
  GND 0.127: v20.83,16.51 20.83,17.78 19.68,18.92 19.68,21.61 19.88,21.8 19.88,23.27 v19.4,23.75
  Bottom 0.127: v20.83,16.51 21.08,16.26 22.86,16.26 22.99,16.13 22.99,12.32 23.11,12.19 23.62,12.19 23.75,12.06 23.75,11.81 23.62,11.68 23.11,11.68 22.99,11.56 22.99,11.3 23.11,11.18 23.62,11.18 23.75,11.05 23.75,10.79 23.62,10.67 23.11,10.67 22.99,10.54 22.99,10.16 23.11,10.03 23.62,10.03 23.75,9.91 23.75,9.4 23.52,9.17 U2.10
D8  (via drill 0.25, 0.3)
  Top 0.127: v18.6,23.75 U1.F12
  PWR 0.127: v19.88,17.97 19.88,18.8 20,18.92 20.19,18.92 20.32,19.05 20.32,19.3 20.19,19.43 18.67,19.43 18.54,19.56 18.54,19.81 18.67,19.94 19.3,19.94 19.43,20.07 19.43,20.32 19.3,20.45 18.67,20.45 18.54,20.57 18.54,20.83 18.67,20.95 19.3,20.95 19.43,21.08 19.43,21.34 19.3,21.46 18.67,21.46 18.54,21.59 18.54,23.69 v18.6,23.75
  Bottom 0.127: v19.88,17.97 20.19,17.97 20.32,18.1 20.32,18.29 20.45,18.41 20.7,18.41 20.83,18.29 20.83,18.03 20.95,17.91 21.21,17.91 21.34,18.03 21.34,18.54 21.21,18.67
  Bottom 0.381: U2.42 21.12,18.76 21.21,18.67
D9  (via drill 0.25)
  Top 0.127: U1.E13 v19.4,22.95
  Bottom 0.127: v19.4,22.95 19.72,22.95 19.94,22.73 27.3,22.73 27.43,22.61 27.43,22.35 27.3,22.23 25.91,22.23 25.78,22.1 25.78,21.84 25.91,21.72 27.3,21.72 27.43,21.59 27.43,21.34 27.3,21.21 25.91,21.21 25.78,21.08 25.78,20.7 25.15,20.07
  Bottom 0.381: U2.47 25.15,19.44 25.15,20.07
D10  (via drill 0.25)
  Top 0.127: v19.4,22.15 U1.E14
  Bottom 0.127: v19.4,22.15 19.48,22.23 19.94,22.23 20.19,21.97 20.57,21.97 20.83,22.23 21.21,22.23 21.46,21.97 21.84,21.97 22.1,22.23 24.89,22.23 25.02,22.1 25.02,21.84 24.89,21.72 23.11,21.72 22.99,21.59 22.99,21.34 23.11,21.21 24.89,21.21 25.02,21.08 25.02,20.83 24.89,20.7 23.11,20.7 22.99,20.57 22.99,20.32
  Bottom 0.254: 22.72,20.05 22.99,20.32
  Bottom 0.381: U2.44 22.72,20.05
D11  (via drill 0.25)
  Top 0.127: U1.G11 v17.8,24.55
  Bottom 0.127: v17.8,24.55 18.2,24.15 19.65,24.15 20.55,23.24 27.94,23.24 28.19,22.99 28.19,20.32
  Bottom 0.381: U2.51 28.32,20.19 28.19,20.32
D12  (via drill 0.25)
  Top 0.127: v17.8,23.75 U1.G12
  Bottom 0.127: v17.8,23.75 18.2,23.35 19.72,23.35 20.08,22.99 27.43,22.99 27.69,22.73 27.69,20.95 27.43,20.7 26.42,20.7 25.91,20.19
  Bottom 0.381: U2.48 25.91,19.44 25.91,20.19
D13  (via drill 0.3)
  Top 0.127: U1.F13 18.6,22.95 18.6,21.75 19.43,20.92 19.43,20.07 20.32,19.18 20.32,17.78 21.46,16.64 27.18,16.64 v27.3,16.51
  Bottom 0.254: v27.3,16.51 27.3,18.54 27.43,18.67
  Bottom 0.381: U2.50 27.52,18.76 27.43,18.67
D14  (via drill 0.25)
  Top 0.127: U1.G13 v17.8,22.95
  Bottom 0.127: 23.62,20.32 23.75,20.45 25.15,20.45 25.53,20.83 25.53,21.21 25.27,21.46 25.27,21.84 25.53,22.1 25.53,22.35 25.4,22.48 19.79,22.48 19.72,22.55 18.85,22.55 18.8,22.61 18.8,22.86 18.67,22.99 18.41,22.99 18.29,22.86 18.29,22.23 18.16,22.1 17.91,22.1 17.8,22.2 v17.8,22.95
  Bottom 0.254: U2.45 23.62,19.44 23.62,20.32
D15  (via drill 0.3)
  Top 0.127: v29.21,18.16 28.19,18.16 26.92,16.89 21.59,16.89 20.57,17.91 20.57,19.3 19.68,20.19 19.68,21.08 18.92,21.84 18.92,22.47 U1.F14
  Bottom 0.254: v29.21,18.16 29.92,18.87
  Bottom 0.381: 29.92,18.87 U2.53
DCD_N  (via drill 0.25)
  Top 0.127: U1.J4 v16.2,30.95
  PWR 0.127: v16.2,30.95 16.6,31.35 16.6,34 19.3,36.7 31.62,36.7 34.29,34.04 34.29,24.38 34.8,23.88 34.8,23.49 35.69,22.61 35.69,21.08 36.45,20.32 38.1,20.32 38.61,20.83
  PWR 1.016: 38.61,20.83 EXT2.12
DQM0  (via drill 0.25, 0.3)
  Top 0.127: v17,25.35 U1.J10
  PWR 0.127: v17,25.35 17.4,24.95 17.4,18.29 18.92,16.76 v18.92,15.75
  Bottom 0.127: v18.92,15.75 19.18,15.49 19.18,15.11 19.05,14.99 18.8,14.99 18.67,14.86 18.67,14.61 18.8,14.48 19.05,14.48 19.18,14.35 19.18,14.1 19.05,13.97 18.8,13.97 18.67,13.84 18.67,13.59 18.8,13.46 19.05,13.46 19.18,13.34 19.18,13.08 19.05,12.95 18.8,12.95 18.67,12.83 18.67,12.57 18.8,12.45 19.05,12.45 19.18,12.32 19.18,12.06 19.05,11.94 18.8,11.94 18.67,11.81 18.67,11.56 18.8,11.43 19.05,11.43 19.18,11.3 19.18,8.76 19.52,8.42 U2.15
DQM1  (via drill 0.3)
  Top 0.127: U1.M13 13.8,22.95 13.8,22.18 12.95,21.34 12.95,18.54 v12.7,18.29
  GND 0.127: v12.7,18.29 13.72,18.29 14.1,17.91 14.73,17.91 14.86,18.03 14.86,18.67 14.99,18.8 15.24,18.8 15.37,18.67 15.37,18.03 15.49,17.91 15.75,17.91 15.88,18.03 15.88,18.67 16,18.8 17.14,18.8 17.27,18.67 17.27,18.41 17.4,18.29 17.65,18.29 17.78,18.41 17.78,18.67 17.91,18.8 18.16,18.8 18.29,18.67 18.29,18.41 18.41,18.29 v18.67,18.29
  Bottom 0.381: v18.67,18.29 18.72,18.34 U2.39
DSR_N  (via drill 0.25)
  Top 0.127: U1.L3 v14.6,31.75
  PWR 0.127: v14.6,31.75 15.11,32.26 15.11,32.51 16,33.4 16,34.16 19.05,37.21 31.88,37.21 34.8,34.29 34.8,25.15 35.56,24.38 35.56,23.75 36.45,22.86 38.1,22.86 38.61,23.37
  PWR 1.016: 38.61,23.37 EXT2.14
DTR_N  (via drill 0.25)
  Top 0.127: U1.N4 v13,30.95
  PWR 0.127: v13,30.95 13,33.25 13.4,33.65 13.4,34.35 13.72,34.67 14.48,34.67 15.24,35.43 16.51,35.43 18.8,37.72 32.13,37.72 35.31,34.54 35.31,26.03 35.94,25.4 38.1,25.4 38.61,25.91
  PWR 1.016: 38.61,25.91 EXT2.16
EJTAG_TCK  (via drill 0.3)
  Top 0.127: U1.A12 23.1,24.05 23.32,24.05 23.75,23.62 23.75,23.37 25.15,21.97 32.38,21.97 32.77,21.59 33.53,21.59 v33.91,21.21
  Bottom 0.127: 38.1,17.78 35.81,17.78 35.56,18.03 35.56,19.56 v33.91,21.21
  Bottom 1.016: 38.1,17.78 EXT2.8
EJTAG_TDI  (via drill 0.3)
  Top 0.127: U1.A14 23,21.83 23.62,21.21 32,21.21 32.89,20.32 33.66,20.32 v33.78,20.19
  Bottom 0.127: 38.1,15.24 35.69,15.24 35.05,15.88 35.05,18.92 v33.78,20.19
  Bottom 1.016: 38.1,15.24 EXT2.6
EJTAG_TDO  (via drill 0.3)
  Top 0.127: U1.B11 22.6,24.55 23.27,24.55 24,23.82 24,23.49 25.27,22.23 32.51,22.23 32.89,21.84 33.66,21.84 v33.78,21.97
  Bottom 0.127: v33.78,21.97 33.91,21.97 36.45,19.43
  Bottom 1.016: 36.45,19.43 EXT2.9
EJTAG_TMS  (via drill 0.3)
  Top 0.127: v33.02,20.83 32.77,20.83 32.13,21.46 24.89,21.46 U1.A13
  Bottom 0.127: v33.02,20.83 33.15,20.7 34.04,20.7 35.31,19.43 35.31,17.14 35.94,16.51
  Bottom 1.016: 35.94,16.51 EXT2.7
EJTAG_TRSTN  (via drill 0.3)
  Top 0.127: U1.A11 23.1,24.85 23.45,24.85 24.26,24.04 24.26,23.62 25.4,22.48 32.89,22.48 v33.02,22.35
  Bottom 0.127: v33.02,22.35 33.15,22.48 34.04,22.48 36.2,20.32 38.1,20.32
  Bottom 1.016: 38.1,20.32 EXT2.10
EXT_LDO_1P2  (via drill 0.25)
  Top 0.127: v17,31.75 U1.H3
  GND 0.127: v17,31.75 U1.H3 17.4,30.75 17,30.35 17,29.15 16.7,28.85 16.7,28.45 16.4,28.15 12.28,28.15 8.26,24.13 8.26,22.99 6.35,21.08 6.35,18.67 10.03,14.99 10.03,12.45 12.95,9.52 12.95,4.19 13.72,3.43 15.88,3.43 16.13,3.17 18.29,3.17 18.54,2.92 20.7,2.92 20.95,2.67 23.11,2.67 23.37,2.41 25.53,2.41 26.29,1.65
  GND 1.016: 26.29,1.65 EXT3.11
FB  (via drill 0.25)
  Top 0.127: v17,30.95 U1.H4
  GND 0.127: v17,30.95 17,30.75 16.7,30.45 16.7,29.25 16.4,28.95 15.8,28.95 15.54,29.21 12.95,29.21 8,24.26 8,23.11 6.1,21.21 6.1,18.54 8.51,16.13 8.51,13.59 12.7,9.4 12.7,4.06 13.59,3.17 15.75,3.17 16,2.92 18.16,2.92 18.41,2.67 20.57,2.67 20.83,2.41 22.99,2.41 23.75,1.65
  GND 1.016: 23.75,1.65 EXT3.10
GND  (via drill 0.25, 0.3, 0.4, 0.5, 0.6)
  Top 0.127: v15.4,26.15 U1.L10 v14.6,25.35 U1.M10 v13.8,25.35 U1.N10 v13,25.35 U1.P10 12.12,25.27 v11.68,25.27 | v15.4,26.15 U1.K10 | v13.8,24.55 U1.M11 | v13.8,23.75 U1.M12 | v13,22.95 U1.N13 | v13,22.15 U1.N14 | v11.68,22.48 12.53,22.48 U1.P14 | U1.D9 v20.2,26.95 U1.E9 | U1.D8 v20.2,27.75 U1.E8 | U1.D7 v20.2,28.55 U1.D6 | U1.A4 23.1,30.55 v23.6,31.05 | v21.8,30.15 U1.C5 | U1.F7 v19.4,27.75 U1.E7 | U1.F6 v19.4,28.55 U1.E6 | U1.D5 v20.2,29.35 U1.E5 | v21.8,30.95 U1.B4 | U1.C4 v21,30.95 U1.D4 | v19.4,30.95 U1.E4 | v22.6,32.55 U1.B2 | v23.4,32.55 U1.A1 | v21.8,31.75 U1.C3 | U1.D3 v21,31.75 | v21.8,32.55 U1.C2 | v21,32.55 U1.D2 20.5,32.05 19.9,32.05 U1.E2 | v15.4,26.15 U1.K9 v16.2,26.95 | U1.F8 v18.6,27.75 U1.G8 | U1.J8 U1.H8 | U1.G6 v18.6,28.55 U1.G7 v17.8,28.55 | v18.6,30.95 U1.F4 | U1.F3 v18.6,31.75 U1.F2 | v19.4,33.35 U1.F1 | v17.8,28.55 U1.H7 | U1.J8 16.7,27.45 16.7,28.05 U1.J7 v16.2,28.55 U1.J6 U1.H6 v17.8,28.55 | v16.2,26.95 U1.J9 | v16.2,26.95 U1.J8
  Top 0.254: v24.64,31.24 24.64,33.91 24.38,34.16 21.72,34.16 21.72,33.4 | v20.07,34.92 20.19,34.8 20.19,33.27 | v30.48,27.05 30.48,26.92 29.97,26.42 28.57,26.42 v28.07,25.91 | 26.92,15.49 28.7,15.49 29.21,16 29.21,16.51
  Top 0.381: 17.02,37.97 17.02,37.85
  Top 0.508: 32,35.81 C51.2 | 32,35.81 C52.2 | 30.35,19.18 C6.2 | 30.35,19.18 v31.37,19.18 | v25.53,18.16 25.53,18.67 C5.2 | 10.79,18.16 11.3,18.16 C53.2 | v9.91,18.16 10.79,18.16 | v28.45,32.26 27.43,32.26 L3.2 | 26.92,25.91 26.67,26.16 26.67,26.54 C27.2 | v15.24,34.8 14.73,34.8 R14.2 | v24.64,31.24 25.02,30.86 C31.2 | 17.02,37.85 17.02,34.43 v17.5,33.95 | 35.05,35.81 32,35.81 | 35.05,22.73 33.55,22.73 33.05,23.24 C50.2 | 10.79,18.16 10.79,21.72 11.56,22.48 v11.68,22.48 | C23.2 30.35,19.18 | 26.42,37.97 C47.2 | 20.07,35.69 v20.07,34.92 v19.56,34.92 19.56,35.69 C15.2 20.07,35.69
  Top 0.61: v6.86,23.62 C55.2 | 5.59,30.1 C56.2 | v9.65,46.36 WLAN_ACT.C | 33.4,3.05 PWR_LED.C | v19.56,6.12 20.3,6.86 C58.2
  Top 0.762: U5.2 13.72,13.46 13.34,13.84 v13.34,14.22 | U4.2 27.05,13.46 v26.92,13.59 | U7.2 17.02,5.97 v17.21,5.78
  Top 1.016: v9.02,10.03 9.27,10.29 R24.2 9.27,11.94 9.91,12.57 C32.2 | 5.59,8.89 5.59,30.1 5.59,37.97 10.03,37.97 | 5.59,8.89 5.59,3.05 29.21,3.05 | 29.21,3.05 33.4,3.05 35.05,3.05 | 35.05,3.05 35.05,22.73 35.05,35.81 35.05,37.97 31.75,37.97 31.47,38.25 ANT.GND2 | 10.03,37.97 13.84,37.97 | 13.84,37.97 17.02,37.97 19.81,37.97 | 19.81,37.97 26.42,37.97 28.19,37.97 28.47,38.25 ANT.GND1 | 21.46,12.57 21.84,12.57 | 21.46,12.57 C35.2 | C22.2 C34.2 21.84,12.57 | 21.84,10.92 R22.2 | 21.84,10.92 21.84,12.57 | 21.46,10.92 21.84,10.92 | 21.46,12.57 v21.46,11.3 21.46,10.92 | v21.46,10.41 21.46,10.92 | 30.35,17.14 v29.34,17.14 | C24.2 30.35,17.14 | 30.35,17.14 C23.2 | U6.3 9.1,18.16 v9.91,18.16 | 13.84,37.97 R14.2 | 10.03,37.97 R29.2 | 26.92,25.02 C17.2 | 26.92,25.02 v28.07,25.02 v28.07,25.91 26.92,25.91 C29.2 26.92,25.02 | C49.2 26.29,31.62 26.92,32.26 v28.45,32.26 | 5.59,8.89 EXT1.2 | 39.37,3.05 EXT2.2 | 35.05,3.05 39.37,3.05 | 29.21,3.05 C9.2 | 19.81,37.97 C15.2 | 39.37,3.05 EXT3.16 | C61.2 C59.2 v8.51,8.51 | C58.2 20.57,6.86 21.46,7.75 R40.2
  GND 0.254: v17.5,33.95 17.6,33.85 18.1,33.85 18.6,33.35 v21,30.95 | v13.34,14.22 18.29,14.22 18.29,17.27 | 13.34,16.76 13.08,17.02 11.94,17.02
  GND 0.381: v19.4,30.95 v18.6,30.95 v18.6,31.75 18.6,33.35 | 21.8,26.95 22.6,27.75 | v11.68,22.48 12.01,22.15 v13,22.15 v13,22.95 13,23.25 13.5,23.75 v13.8,23.75 v13.8,24.55 v13.8,25.35 | v13.8,25.35 v14.6,25.35 16.2,25.35 17,26.15 17.4,26.15 | v13.8,25.35 v13,25.35 | 11.5,30.25 13.1,31.85
  GND 0.508: v21.8,30.95 v21,30.95 20.2,30.95 | 20.2,30.95 v19.4,30.95 | 21.8,26.95 v20.2,26.95 v20.2,27.75 v20.2,28.55 v20.2,29.35 20.2,30.95
  GND 0.762: v21.8,30.95 23.5,30.95 v23.6,31.05 | v24.64,31.24 24.45,31.05 v23.6,31.05 | v23.6,31.05 23.6,28.15 23.2,27.75 22.6,27.75
  Bottom 0.127: v17.5,33.95 17.6,33.85
  Bottom 0.254: U2.6 26.72,7.16 26.16,6.6 v25.53,6.6 | v23.6,31.05 23.7,30.95 | v25.53,18.16 25.4,18.03 25.4,14.73 24.38,13.72 | C13.2 15.4,26.77 v15.4,26.15 15.9,25.65 C12.2 | 17.6,33.85 18.31,33.85 C25.2 | C8.2 21.59,5.59 19.56,5.59
  Bottom 0.381: U2.54 30.72,19.69 30.99,19.69 | 20.2,28.15 v20.2,27.75 | 20.2,28.15 C41.2 | 20.2,28.15 v20.2,28.55 v20.2,29.35 | v17.5,33.95 17.19,34.26 C2.2 | v15.24,34.8 15.66,34.8 C3.2 | v13,25.35 v13.8,25.35 v14.6,25.35 | 19.94,33.64 19.65,33.35 v19.4,33.35
  Bottom 0.406: C14.2 | 21.92,6.77 25.36,6.77 v25.53,6.6
  Bottom 0.508: v13.72,44.96 13.21,45.47 C11.2 | 21.92,9.96 U2.12 21.92,6.77 21.92,6.55 C8.2 | U2.41 20.32,20.51 v20.26,20.57 | U2.46 24.32,18.61 24.77,18.16 v25.53,18.16 | 9.78,19.05 9.92,19.19 U2.28 | U2.52 29.12,20.36 29.46,20.7 30.48,20.7 30.73,20.45 | R11.2 30.86,37.08 28.83,35.05 v28.83,34.42 | C40.2 20.69,26.95 v20.2,26.95 | 28.07,25.4 C20.2 | 28.07,28.07 R25.1 | C42.2 24.38,31.5 24.38,31.24 | v20.07,34.92 19.94,34.92 | v19.56,34.92 19.94,34.92 | 19.94,34.92 19.94,34.67 | v14.6,25.35 15.81,25.35 C12.2 | 25.02,32.51 23.88,32.51 23.85,32.55 v23.4,32.55 v22.6,32.55 v21.8,32.55 | v21.8,32.55 21.6,32.55 | 21.6,32.55 v21,32.55 | 21.6,33.65 21.6,32.55 | v19.4,28.55 v18.6,28.55 18.49,28.55 | v19.4,27.75 v18.6,27.75 18.49,27.75 | 18.49,27.75 C19.2 | C18.2 C16.2 17.49,28.55 v17.8,28.55 18.34,28.55 | v21.8,32.55 v21.8,31.75 v21.8,30.95 | v21,30.95 21.11,30.95 | 21.8,30.25 v21.8,30.15 | 8.51,6.22 C7.2 | 18.34,28.55 C4.2 | 18.49,28.55 18.49,27.75 | 18.34,28.55 18.49,28.55 | 21.11,30.95 C10.2 21.8,30.25 | v21.8,30.95 21.11,30.95 | v21.8,30.95 21.8,30.25 | 28.07,27.18 C28.2 | 28.07,26.29 C26.2
  Bottom 0.61: C57.2 5.97,30.61 v5.59,30.99 | C1.2 9.41,25.92 8.51,25.02 R12.2 | C54.2 7.11,23.62 | 28.07,28.96 C43.2
  Bottom 0.762: R12.2 8.13,24.64 7.11,23.62 v6.86,23.62 | v9.65,46.36 10.03,45.97 R16.1 | 21.92,9.96 v21.46,10.41 v21.46,11.3 | v9.91,18.16 9.78,18.29 9.78,19.05 | v31.37,19.18 30.99,19.18 30.99,19.69 30.99,20.19 30.73,20.45 | C38.2 23.5,30.75 23.7,30.95 23.99,31.24 24.38,31.24 | C30.2 19.94,33.64 19.94,34.67 | 25.02,33.27 C37.2 | 25.02,33.27 C36.2 | 25.02,31.24 25.02,32.51 25.02,33.27 | v8.51,8.51 8.51,6.22 8.51,5.84 9.02,5.33 11.3,5.33 11.93,4.7 Z1.A | v19.56,6.12 19.56,5.59 19.56,5.08 17.14,5.08 17.14,5.33
  Bottom 1.016: U3.4 v7.24,37.97 | R18.2 13.72,44.2 v13.72,44.96 | R7.2 R6.2 31.24,27.05 | 31.24,27.05 R9.2 | 31.24,27.05 R8.2 R5.2 | v30.48,27.05 31.24,27.05 | C39.2 26.67,24.13 27.56,25.02 v28.07,25.02 28.07,25.4 v28.07,25.91 28.07,26.29 28.07,27.18 28.07,28.07 28.07,28.96 28.07,29.59 26.42,31.24 25.02,31.24 v24.64,31.24 24.38,31.24 | C30.2 20.11,33.65 21.6,33.65 C14.2 | Z1.A 13.46,4.06 | 17.21,5.33 17.21,4.19 Z2.A | v17.21,5.78 17.21,5.33 | 17.21,5.33 17.14,5.33 15.37,5.33
  other vias: 8.51,37.97 35.05,36.2 13.84,37.46 5.59,3.68 5.59,3.94 5.59,4.19 5.59,4.44 5.59,4.7 5.59,4.95 5.59,5.21 35.05,3.68 35.05,3.94 35.05,4.19 35.05,4.44 35.05,4.7 35.05,4.95 35.05,5.21 15.37,37.97 15.62,37.97 15.88,37.97 16.13,37.97 16.38,37.97 16.64,37.97 16.89,37.97
  pour Top (isolate 0.305, rank 2): 43.18,50.8 43.31,-2.54 -2.54,-2.54 -2.54,50.8
  pour Bottom (isolate 0.305, rank 2): -10.16,58.42 -10.16,-10.16 50.8,-10.16 50.8,58.42
  pour GND (isolate 0.254, rank 2): -5.08,53.34 -5.08,-5.08 45.72,-5.08 45.72,53.34 34.67,53.34 34.67,38.48 14.86,38.48 14.86,53.34
GPIO0  (via drill 0.3)
  Top 0.127: U1.B12 22.6,23.75 23.25,23.75 23.5,23.5 23.5,23.24 25.02,21.72 32.26,21.72 32.64,21.34 33.15,21.34 33.78,20.7 33.91,20.7 34.29,20.32 34.29,17.4 v34.16,17.27
  Bottom 0.127: v34.16,17.27 34.8,16.64 34.8,15.75 34.8,15.11 35.94,13.97
  Bottom 1.016: 35.94,13.97 EXT2.5
I2C_SCLK  (via drill 0.3)
  Top 0.127: U1.B14 22.2,21.87 23.37,20.7 31.75,20.7 33.27,19.18 33.27,17.65 32.89,17.27 32.89,16 33.91,14.99 33.91,12.95 v33.66,12.7
  Bottom 0.254: 32.77,11.81 v33.66,12.7 38.1,12.7
  Bottom 0.61: R1.1 32.77,11.81
  Bottom 1.016: 38.1,12.7 EXT2.4
I2C_SD  (via drill 0.3)
  Top 0.127: U1.B13 22.6,22.95 22.6,21.85 23.5,20.95 31.88,20.95 33.53,19.3 33.53,17.53 33.15,17.14 33.15,16.13 34.16,15.11 v34.16,11.94
  Bottom 0.762: R2.1 34.16,11.18 v34.16,11.94
  Bottom 1.016: EXT2.3 36.45,11.05 R2.1
LDOSEL  (via drill 0.25)
  Top 0.127: v17.8,30.95 U1.G3
  GND 0.127: v17.8,30.95 17.8,30.75 17.3,30.25 17.3,29.05 17,28.75 17,27.95 16.4,27.35 11.86,27.35 8.51,24 8.51,22.86 6.6,20.95 6.6,18.8 10.29,15.11 10.29,12.57 13.21,9.65 13.21,4.32 13.84,3.68 16,3.68 16.26,3.43 18.41,3.43 18.67,3.17 20.83,3.17 21.08,2.92 23.24,2.92 23.5,2.67 25.65,2.67 25.91,2.41 28.07,2.41 28.83,1.65
  GND 1.016: 28.83,1.65 EXT3.12
  Bottom 1.016: EXT3.12 R30.1
LGATE  (via drill 0.25)
  Top 0.127: v16.2,32.55 U1.J1
  GND 0.127: v16.2,32.55 15.8,32.15 15.8,30.55 15.88,30.48 15.88,30.02 15.31,29.46 12.83,29.46 7.75,24.38 7.75,23.24 5.84,21.34 5.84,18.41 8.26,16 8.26,13.46 12.45,9.27 12.45,3.94 13.46,2.92 15.62,2.92 15.88,2.67 18.03,2.67 18.29,2.41 20.45,2.41 21.21,1.65
  GND 1.016: 21.21,1.65 EXT3.9
LINK0  (via drill 0.25)
  Top 0.127: U1.K3 v15.4,31.75
  GND 0.127: v15.4,31.75 15.4,32.93 16,33.53 16,34.16 17.53,35.69 21.21,35.69 27.05,29.84 34.16,29.84 36.07,27.94 38.1,27.94 38.61,28.45
  GND 1.016: 38.61,28.45 EXT2.18
  Bottom 0.254: 33.78,24.77 34.54,25.53 34.54,26.29 36.2,27.94 38.1,27.94
  Bottom 1.016: 33.78,24.77 R7.1 | EXT2.18 38.1,27.94
LINK1  (via drill 0.25)
  Top 0.127: U1.L1 14.6,33.35 v14.6,34.03
  GND 0.127: v14.6,34.03 14.6,34.92 16.13,36.45 21.59,36.45 27.43,30.61 35.31,30.61 35.94,31.24
  GND 1.016: 35.94,31.24 36.45,31.75 EXT2.19
  Bottom 0.254: 33.66,29.34 34.42,29.34 35.94,30.86 35.94,31.24
  Bottom 1.016: 33.66,29.34 R8.1 | EXT2.19 36.45,31.75 35.94,31.24
LINK2  (via drill 0.25)
  Top 0.127: U1.L4 v14.6,30.95
  GND 0.127: v14.6,30.95 15,31.35 15,33.92 17.27,36.2 21.46,36.2 27.3,30.35 35.43,30.35 35.56,30.48 38.1,30.48
  GND 1.016: 38.1,30.48 EXT2.20
  Bottom 0.254: 33.66,27.81 36.32,30.48 38.1,30.48 | R9.1 32.89,27.81 32.13,27.05 32.13,24 31.37,23.24 R42.1
  Bottom 1.016: 33.66,27.81 R9.1 | EXT2.20 38.1,30.48
LINK3  (via drill 0.25)
  Top 0.127: U1.M1 14.2,33.75 v13.8,34.15
  GND 0.127: 36.32,33.78 35.94,33.4 35.94,32.77 34.29,31.12 27.69,31.12 21.84,36.96 15.88,36.96 13.8,34.88 v13.8,34.15
  GND 1.016: 36.32,33.78 EXT2.21
  Bottom 0.254: 35.94,33.91 35.94,33.66 34.8,32.51 33.78,32.51
  Bottom 1.016: 33.78,32.51 R4.1 | EXT2.21 36.32,34.29 35.94,33.91
LINK4  (via drill 0.25)
  Top 0.127: U1.M4 v13.8,30.95
  GND 0.127: v13.8,30.95 14.2,31.35 14.2,34.9 16,36.7 21.72,36.7 27.56,30.86 34.42,30.86 36.58,33.02 38.1,33.02
  GND 1.016: 38.1,33.02 EXT2.22
  Bottom 0.254: 33.53,30.86 33.91,30.86 36.07,33.02 38.1,33.02
  Bottom 1.016: 33.53,30.86 R5.1 | EXT2.22 38.1,33.02
N$1
  Bottom 0.254: 8.89,40.89 9.14,40.64 12.83,40.64
  Bottom 0.508: 8.89,40.89 8.51,41.27
  Bottom 0.762: 8.51,41.27 U3.6 | 12.83,40.64 R17.1
N$2  (via drill 0.25)
  Top 0.127: U1.B8 v22.6,26.95
  Bottom 0.127: v22.6,26.95 23.34,27.69 24.64,27.69 R25.2
  Bottom 0.508: R25.2 C43.1
N$3
  Top 0.254: U1.C1 21.21,33.14 21.21,34.67 C44.1
N$4
  Top 0.127: U1.D1 20.7,33.05
  Top 0.254: 20.7,33.05 20.7,35.18 arc-90 21.21,35.69 21.34,35.69 C45.1
N$5
  Top 0.254: C44.2 22.61,35.05 23.42,35.05 C46.2 23.82,35.05 25.27,35.05 C48.1
  Top 0.508: L3.1 25.4,33.91 C48.1
N$6
  Top 0.254: C45.2 22.61,35.69 23.44,35.69 C46.1 23.8,35.69 25.27,35.69 L4.1
  Top 0.508: L4.1 C47.1
N$7
  Top 0.203: L4.2 26.67,35.56 26.67,35.31 | 26.67,35.31 C62.1 C51.1 | 26.67,35.31 26.67,35.18 C48.2
N$8
  Top 0.127: U1.B7 22.6,27.75 23.5,27.75 23.56,27.81 26.92,27.81 27.05,27.69
  Top 0.508: R26.2 27.43,27.3 27.05,27.69
  Top 1.016: R26.2 R27.1
N$9
  Top 1.016: Q1.1 31.53,25.53 R27.2 C50.1
N$10
  Top 0.127: U1.A7 23.5,28.15 23.58,28.07 26.67,28.07 27.05,28.45
  Top 0.508: 27.05,28.45 R26.1
  Top 1.016: R26.1 28.07,29.08 | 30.35,29.08 31.97,29.08 Q1.2 | 28.07,29.08 C49.1 | 28.07,29.08 30.35,29.08 | 30.35,29.08 30.35,29.21
  Top 1.27: 30.35,29.21 CD1.3
N$11
  Top 0.127: U1.P4 11.87,30.55 R29.1
N$12
  Bottom 0.61: C54.1 8.51,21.84
  Bottom 1.016: R32.2 8.51,21.84 R31.2
N$13
  Top 0.61: C55.1 8.26,25.53
  Top 1.016: R34.2 8.26,25.53 R33.2
N$14
  Top 0.61: C56.1 R36.2
  Top 1.016: R36.2 R35.2
N$15
  Bottom 0.61: 8.51,29.59 C57.1
  Bottom 1.016: R38.2 8.51,29.59 R37.2
N$16
  Top 0.61: PWR_LED.A R41.1
N$18
  Top 0.127: U1.H14 17.4,22.22 17.53,22.1 17.91,22.1 18.03,21.97 18.03,21.72 17.91,21.59 17.02,21.59 16.89,21.46 16.89,21.21 17.02,21.08 17.91,21.08 18.03,20.95 18.03,20.7 17.91,20.57 17.02,20.57 16.89,20.45 16.89,19.81
  Top 0.508: R19.1 16.89,19.43 16.89,19.81
N$19  (via drill 0.3)
  Top 0.127: 18.16,18.92 18.16,18.41 18.03,18.29 17.78,18.29 17.65,18.16 17.65,17.91 17.78,17.78 18.92,17.78 19.05,17.65 19.05,17.4 18.92,17.27 17.78,17.27 17.65,17.14 17.65,16.89 17.78,16.76 18.92,16.76 19.05,16.64 19.05,16.38 18.92,16.26 17.78,16.26 17.65,16.13 v17.65,15.75
  Top 0.457: 18.16,18.92 R19.2
  Bottom 0.127: v17.65,15.75 17.4,16 17.4,16.38 17.53,16.51 18.29,16.51 18.41,16.64 18.41,16.89 18.29,17.02 17.53,17.02 17.4,17.14 17.4,17.4 17.53,17.53 18.29,17.53 18.41,17.65 18.41,17.91 18.29,18.03 17.91,18.03 17.78,18.16 17.78,18.67
  Bottom 0.254: U2.38 17.92,18.81 17.78,18.67
N$20
  pour Top (isolate 1.016): 11.56,33.91 18.16,33.91 19.43,32.64 22.23,32.64 24,30.86 24,21.59 11.56,21.59
N$21
  Top 0.635: U7.3 14.92,5.02 14.28,5.66 L5.1
N$22
  Top 0.762: U7.5 18.7,8.38
  Top 1.016: R40.1 18.7,8.38 R39.2 C60.2
N$23
  Top 0.508: U4.3 28.19,14.41 28.19,14.61
  Top 1.016: L1.1 29.79,14.61 28.19,14.61
N$24
  Top 0.508: U4.5 25.4,12.51 25.4,12.19
  Top 1.016: C21.2 R21.2 25.4,10.92 | R22.1 25.4,10.92 | 25.4,10.92 25.4,12.19
N$26
  Top 0.203: C62.2 C52.1
  Top 0.254: C62.2 ANT.ANT
N$27  (via drill 0.25)
  Top 0.127: v21,25.35 U1.C11
  Bottom 0.127: v21,25.35 20.6,24.95 20.5,24.85 20.5,24.45 20.4,24.35 20.2,24.35 20.1,24.45 20.1,24.85 20,24.95 17.6,24.95 17.4,24.75 17.4,22.15 17.27,22.02 16.89,22.02 16.76,22.15 16.76,23.21 16.63,23.35 15,23.35 14.91,23.27 14.91,23.09 15.02,22.99 15.65,22.99 15.75,22.88 15.75,22.71 15.65,22.61 15.02,22.61 14.91,22.5 14.91,22.33 15.02,22.23 15.65,22.23 15.75,22.12 15.75,21.95 15.65,21.84 15.02,21.84 14.91,21.74 14.91,21.56 15.02,21.46 15.65,21.46 15.75,21.36 15.75,21.18 15.65,21.08 15.02,21.08 14.91,20.98 14.91,20.8 15.02,20.7 16.13,20.7 16.76,21.34
  Bottom 0.406: U2.37 17.12,20.17 17.4,20.45 R15.2 17.4,21.34 16.76,21.34
N$35
  Top 0.61: WLAN_ACT.A 12.32,44.45 R3.1
N$57
  Top 0.127: U1.A6 23.6,28.95
  Top 0.254: 23.6,28.95 24.25,28.95 24.26,28.96
  Top 0.508: 24.26,28.96 C31.1
N$64
  Top 0.508: U5.3 14.86,14.41 14.86,14.61
  Top 1.016: L2.1 16.45,14.61 14.86,14.61
N$66
  Top 0.508: U5.5 12.06,12.48 12.06,12.19
  Top 1.016: 12.06,11.05 R24.1 | 12.06,11.05 R23.2 C33.2 | 12.06,11.05 12.06,12.19
PLL_VCC_1V2  (via drill 0.25)
  Top 0.127: v22.6,28.55 U1.B6 | v21.8,28.55 U1.C6 | U1.C7 v21.8,27.75
  Bottom 0.508: C38.1 v22.6,28.55 v21.8,28.55 v21.8,27.75
PORSTN  (via drill 0.25, 0.4)
  Top 0.127: v21,26.15 U1.C10
  Top 0.254: v10.92,16.89 10.54,17.27 8.89,17.27 8,16.38 8,16.17
  Top 0.61: 8,16.17 U6.1
  GND 0.127: v21,26.15 20.6,25.75 18.3,25.75 17.5,24.95 15.2,24.95 15,24.75 15,23.45 14.9,23.35 13.7,23.35 13.46,23.11 13.46,21.97 13.21,21.72 11.43,21.72 10.92,21.21 v10.92,16.89 11.05,16.76 11.05,12.95 13.97,10.03 13.97,4.7 14.22,4.44 16.38,4.44 16.64,4.19 18.8,4.19 19.05,3.94 21.21,3.94 21.46,3.68 23.62,3.68 23.88,3.43 26.04,3.43 26.29,3.17 28.45,3.17 28.7,2.92 30.86,2.92 31.11,2.67 33.27,2.67 33.53,2.41 35.69,2.41 36.45,1.65
  GND 1.016: 36.45,1.65 EXT3.15
  Bottom 0.254: 1.91,10.79 2.54,10.16 4.57,10.16 7.24,12.83 7.24,16.38 R28.2
  Bottom 0.508: R28.2 8.51,16.89 v10.92,16.89
  Bottom 1.016: 1.91,10.79 EXT1.3
RAS  (via drill 0.25, 0.3)
  Top 0.127: v14.6,24.55 U1.L11
  PWR 0.127: v14.6,24.55 15,24.15 15,23.48 15.37,23.11 15.37,17.91 15.88,17.4 15.88,16.89 16.13,16.64 v16.89,16.64
  Bottom 0.127: v16.89,16.64 16.64,16.38 16.64,8.89 17.12,8.41 U2.18
RF_VCC_1V2  (via drill 0.25)
  Top 0.127: U1.C9 v21.8,26.15 | v21,27.75 U1.C8 | v22.6,29.35 U1.A5 | v21.8,29.35 U1.B5 | v22.6,31.75 U1.B3
  Bottom 0.508: C39.1 21.8,24.3 v21.8,26.15 21.8,26.71 C40.1 21.71,26.94 21,27.65 v21,27.74 | v21,27.74 v21,27.75 | v21,27.74 C41.1 21.01,28.66 21.7,29.35 v21.8,29.35 22.5,29.35 | 22.5,29.35 v22.6,29.35 | 22.5,29.35 22.5,31.65 v22.6,31.75 C42.1
RIN  (via drill 0.25)
  Top 0.127: U1.M3 v13.8,31.75
  PWR 0.127: v13.8,31.75 14.2,32.15 14.2,33 15.37,34.16 15.62,34.16 18.92,37.46 32,37.46 35.05,34.42 35.05,25.91 36.45,24.51
  PWR 1.016: 36.45,24.51 EXT2.13
RTS_N  (via drill 0.25)
  Top 0.127: U1.P2 v12.2,32.55
  PWR 0.127: 36.45,27.05 35.56,27.94 35.56,34.67 32.26,37.97 18.67,37.97 17.14,36.45 15.88,36.45 14.35,34.92 13.34,34.92 12.2,33.79 v12.2,32.55
  PWR 1.016: 36.45,27.05 EXT2.15
RXD  (via drill 0.25, 0.6)
  Top 0.127: U1.N3 13,31.75 v12.2,31.75
  PWR 0.127: 38.1,38.23 18.54,38.23 17.02,36.7 15.75,36.7 14.22,35.18 13.21,35.18 11.8,33.77 11.8,32.15 v12.2,31.75
  PWR 0.254: 38.48,38.48 38.23,38.23 38.1,38.23 v38.1,35.56
  PWR 1.016: 38.48,38.48 EXT2.26
  Bottom 0.254: 34.42,34.04 35.94,35.56 v38.1,35.56
  Bottom 0.762: 34.42,34.04 R13.1
RXIM0  (via drill 0.25)
  Top 0.127: v14.6,30.15 U1.L5
  Bottom 0.127: v14.6,30.15 14.04,29.59 10.92,29.59 R38.1 | 1.91,34.92 2.41,35.43 4.45,35.43 5.08,34.8 5.08,33.02 6.73,31.37 9.02,31.37 9.4,30.99 9.4,29.84 9.91,29.34
  Bottom 0.508: 9.91,29.34 R38.1
  Bottom 1.016: EXT1.21 1.91,34.92
RXIM1  (via drill 0.25)
  Top 0.127: v14.6,28.55 U1.L6
  Bottom 0.127: v14.6,28.55 14.4,28.55 13.98,28.13 13.14,28.13 12.95,27.94 7.75,27.94 6.99,28.7 6.1,28.7 4.45,30.35 2.41,30.35 1.91,29.84
  Bottom 1.016: EXT1.17 1.91,29.84